# EasyEDA Pro project ProPrj_GoWinSDR_SMT_2025-10-27.epro, schematic Schematic1_1, sheets 1 to 4 of 8

## Sheets
1 CoreConnect: Board Name: Board1; Create Date: 2025-10-20; Page Name: CoreConnect; Project Name: GoWinSDR_SMT; Schematic Name: Schematic1; Update Date: 2025-10-20; Drawed: ConstString; Page Size: A4; Version: V1.0
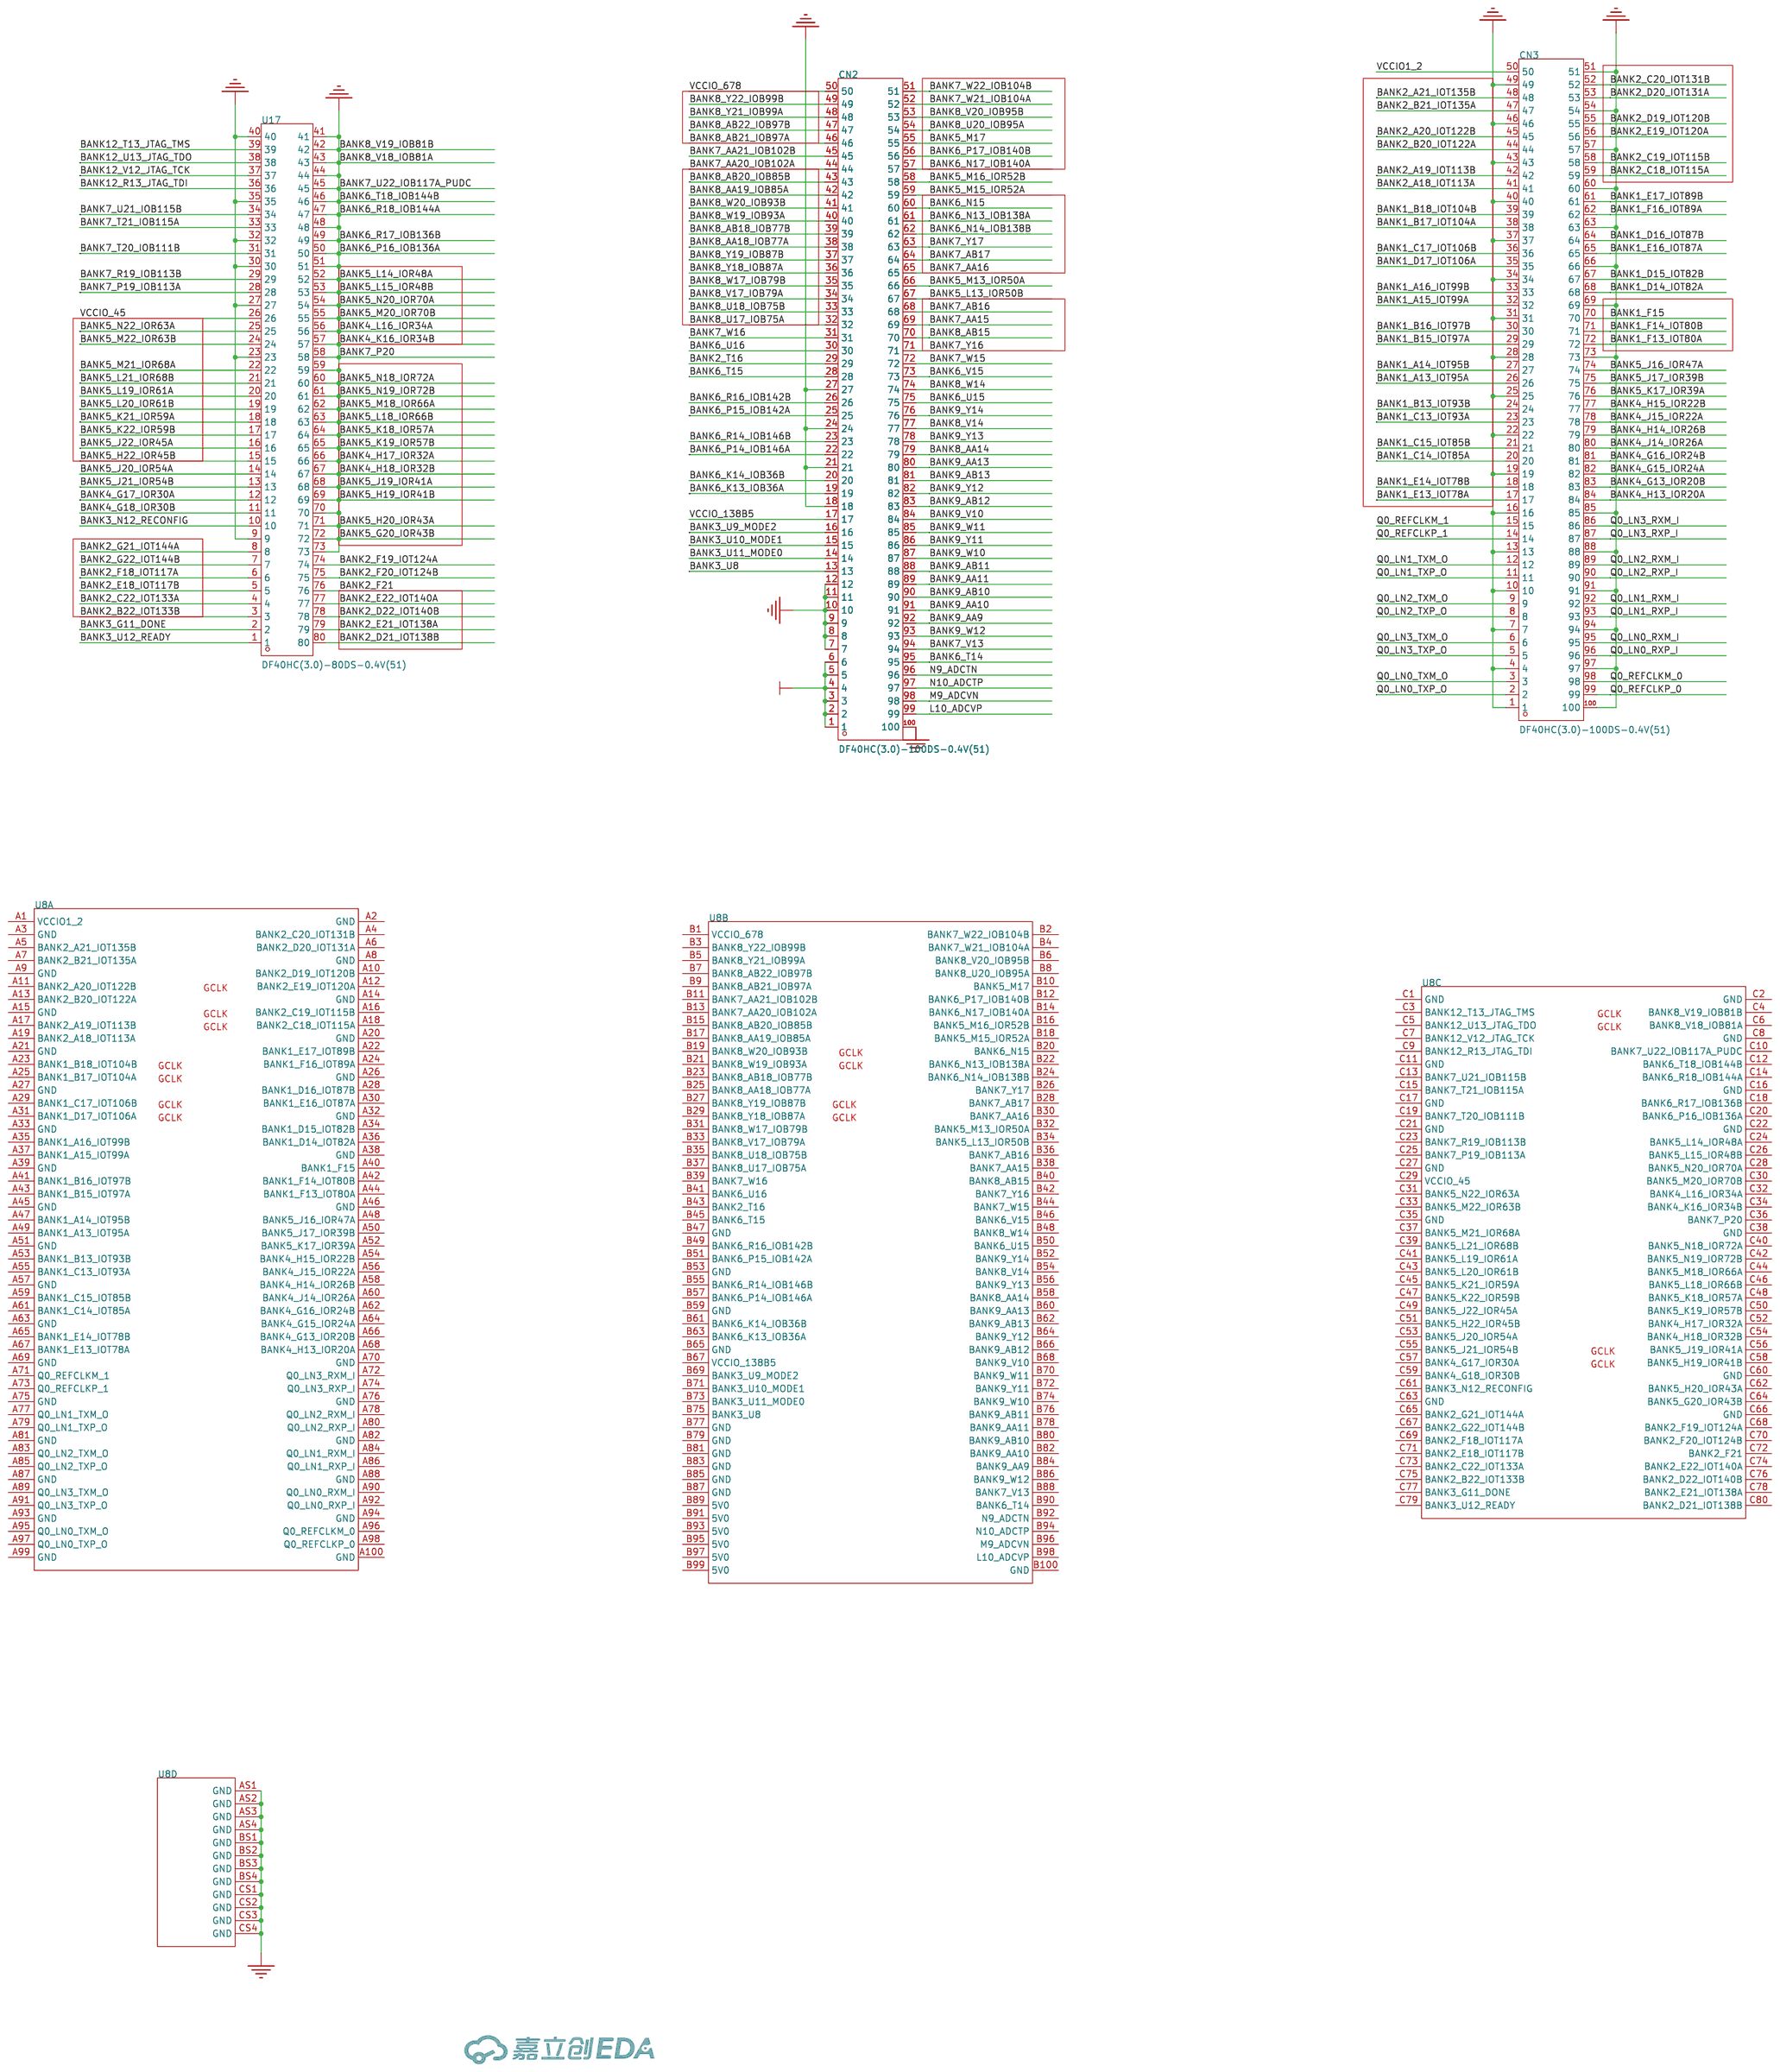
[diagram p0: CoreConnect]
2 AD9363: Create Date: 2025-09-04; Page Name: AD9363; Project Name: GoWinSDR; Update Date: 2025-09-28; Company: 嘉立创EDA
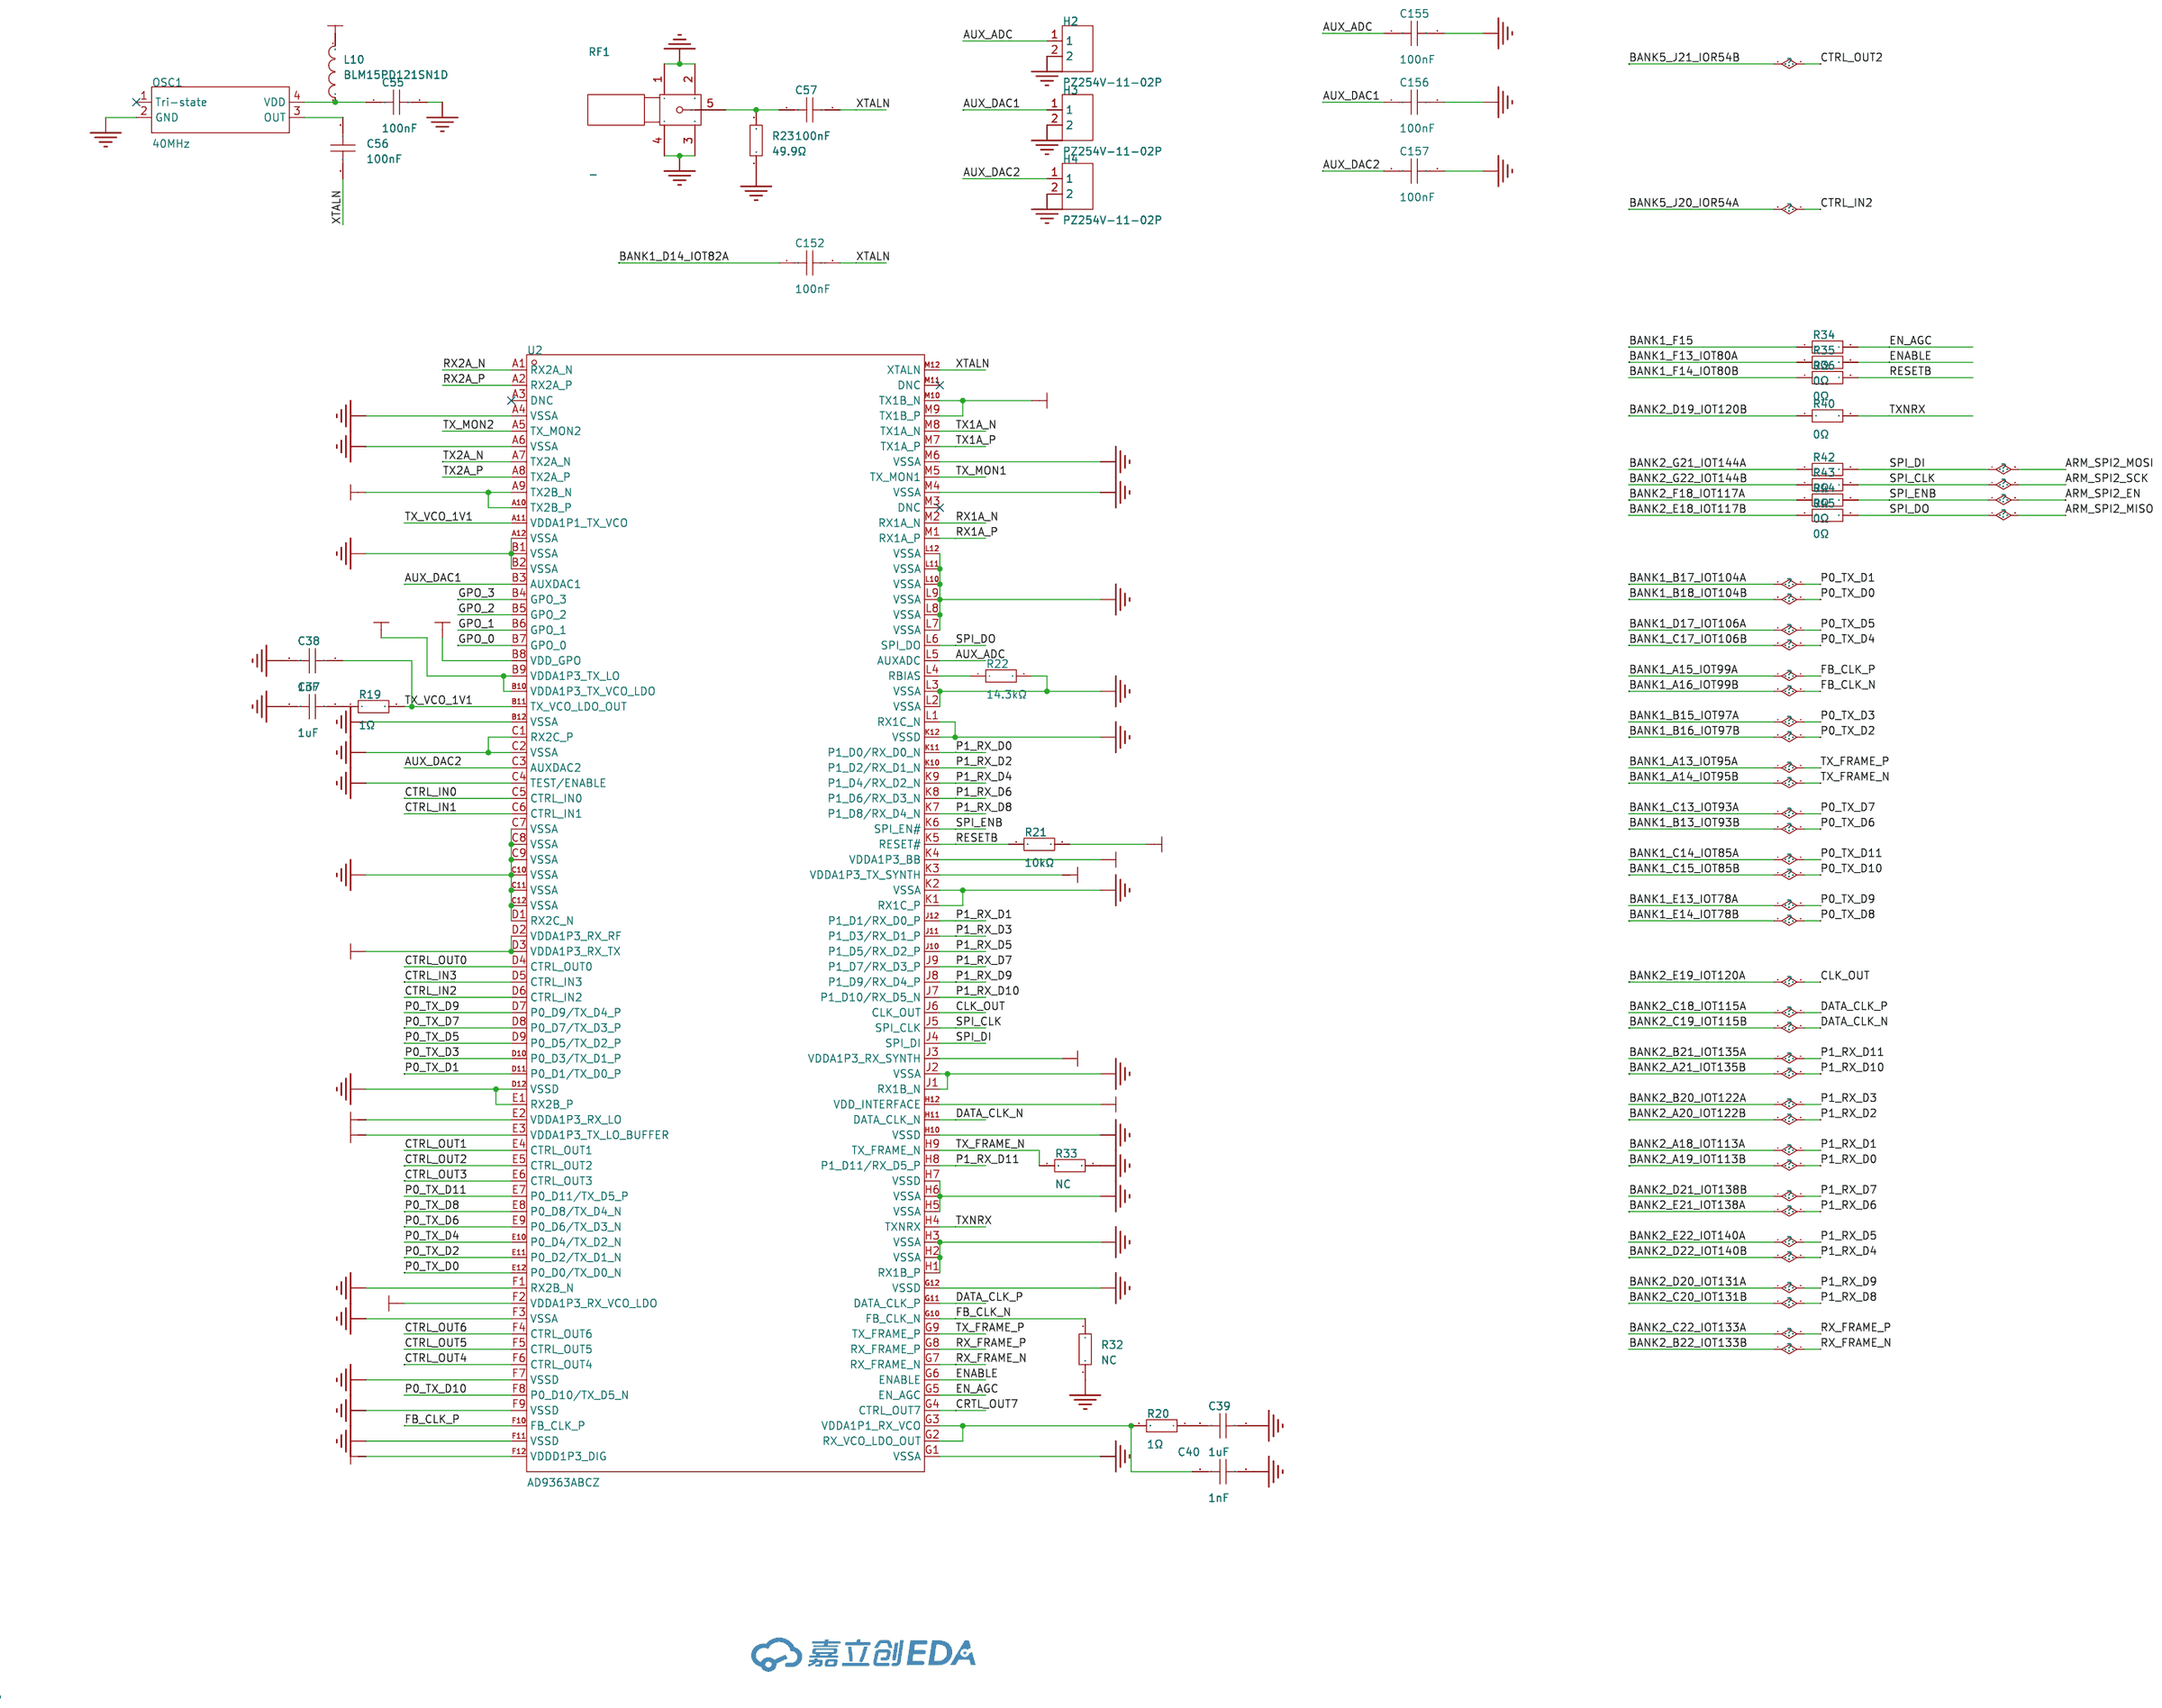
[diagram p1: AD9363]
3 Power: Create Date: 2025-09-04; Page Name: Power; Project Name: GoWinSDR; Update Date: 2025-09-11; Company: 嘉立创EDA
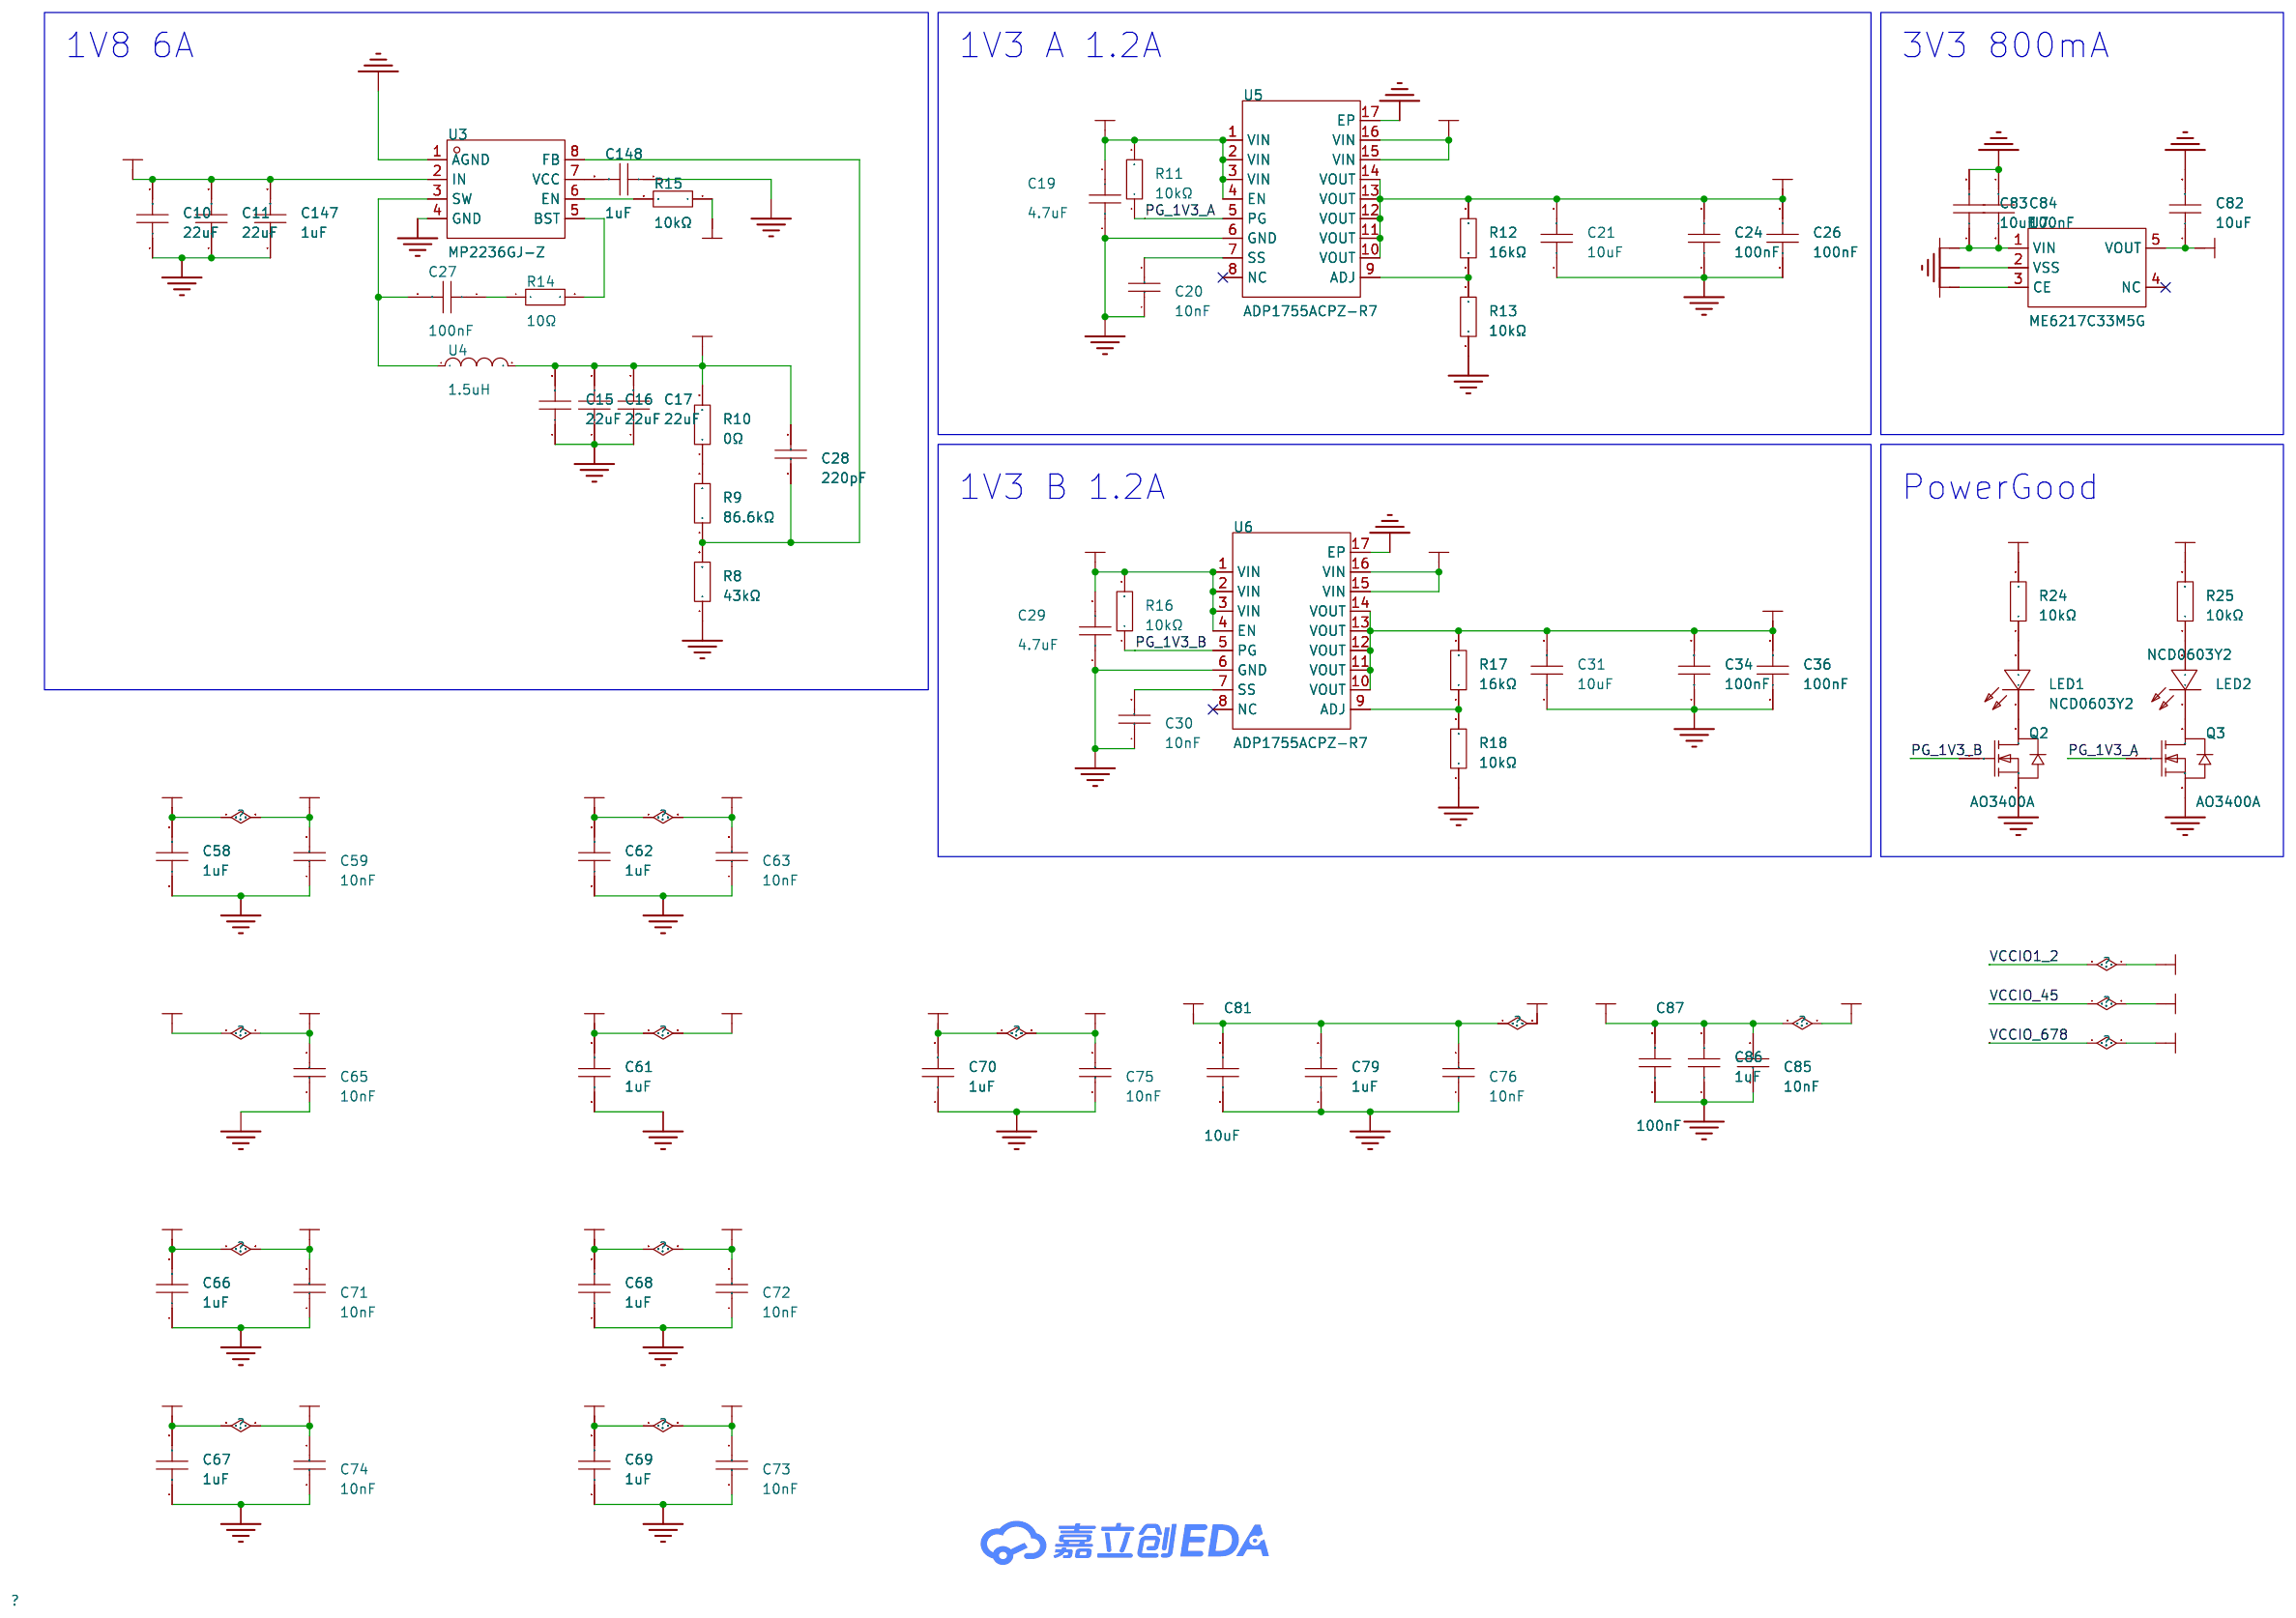
[diagram p2: Power]
4 MCU: Create Date: 2025-09-04; Page Name: MCU; Project Name: GoWinSDR; Update Date: 2025-09-26; Company: 嘉立创EDA
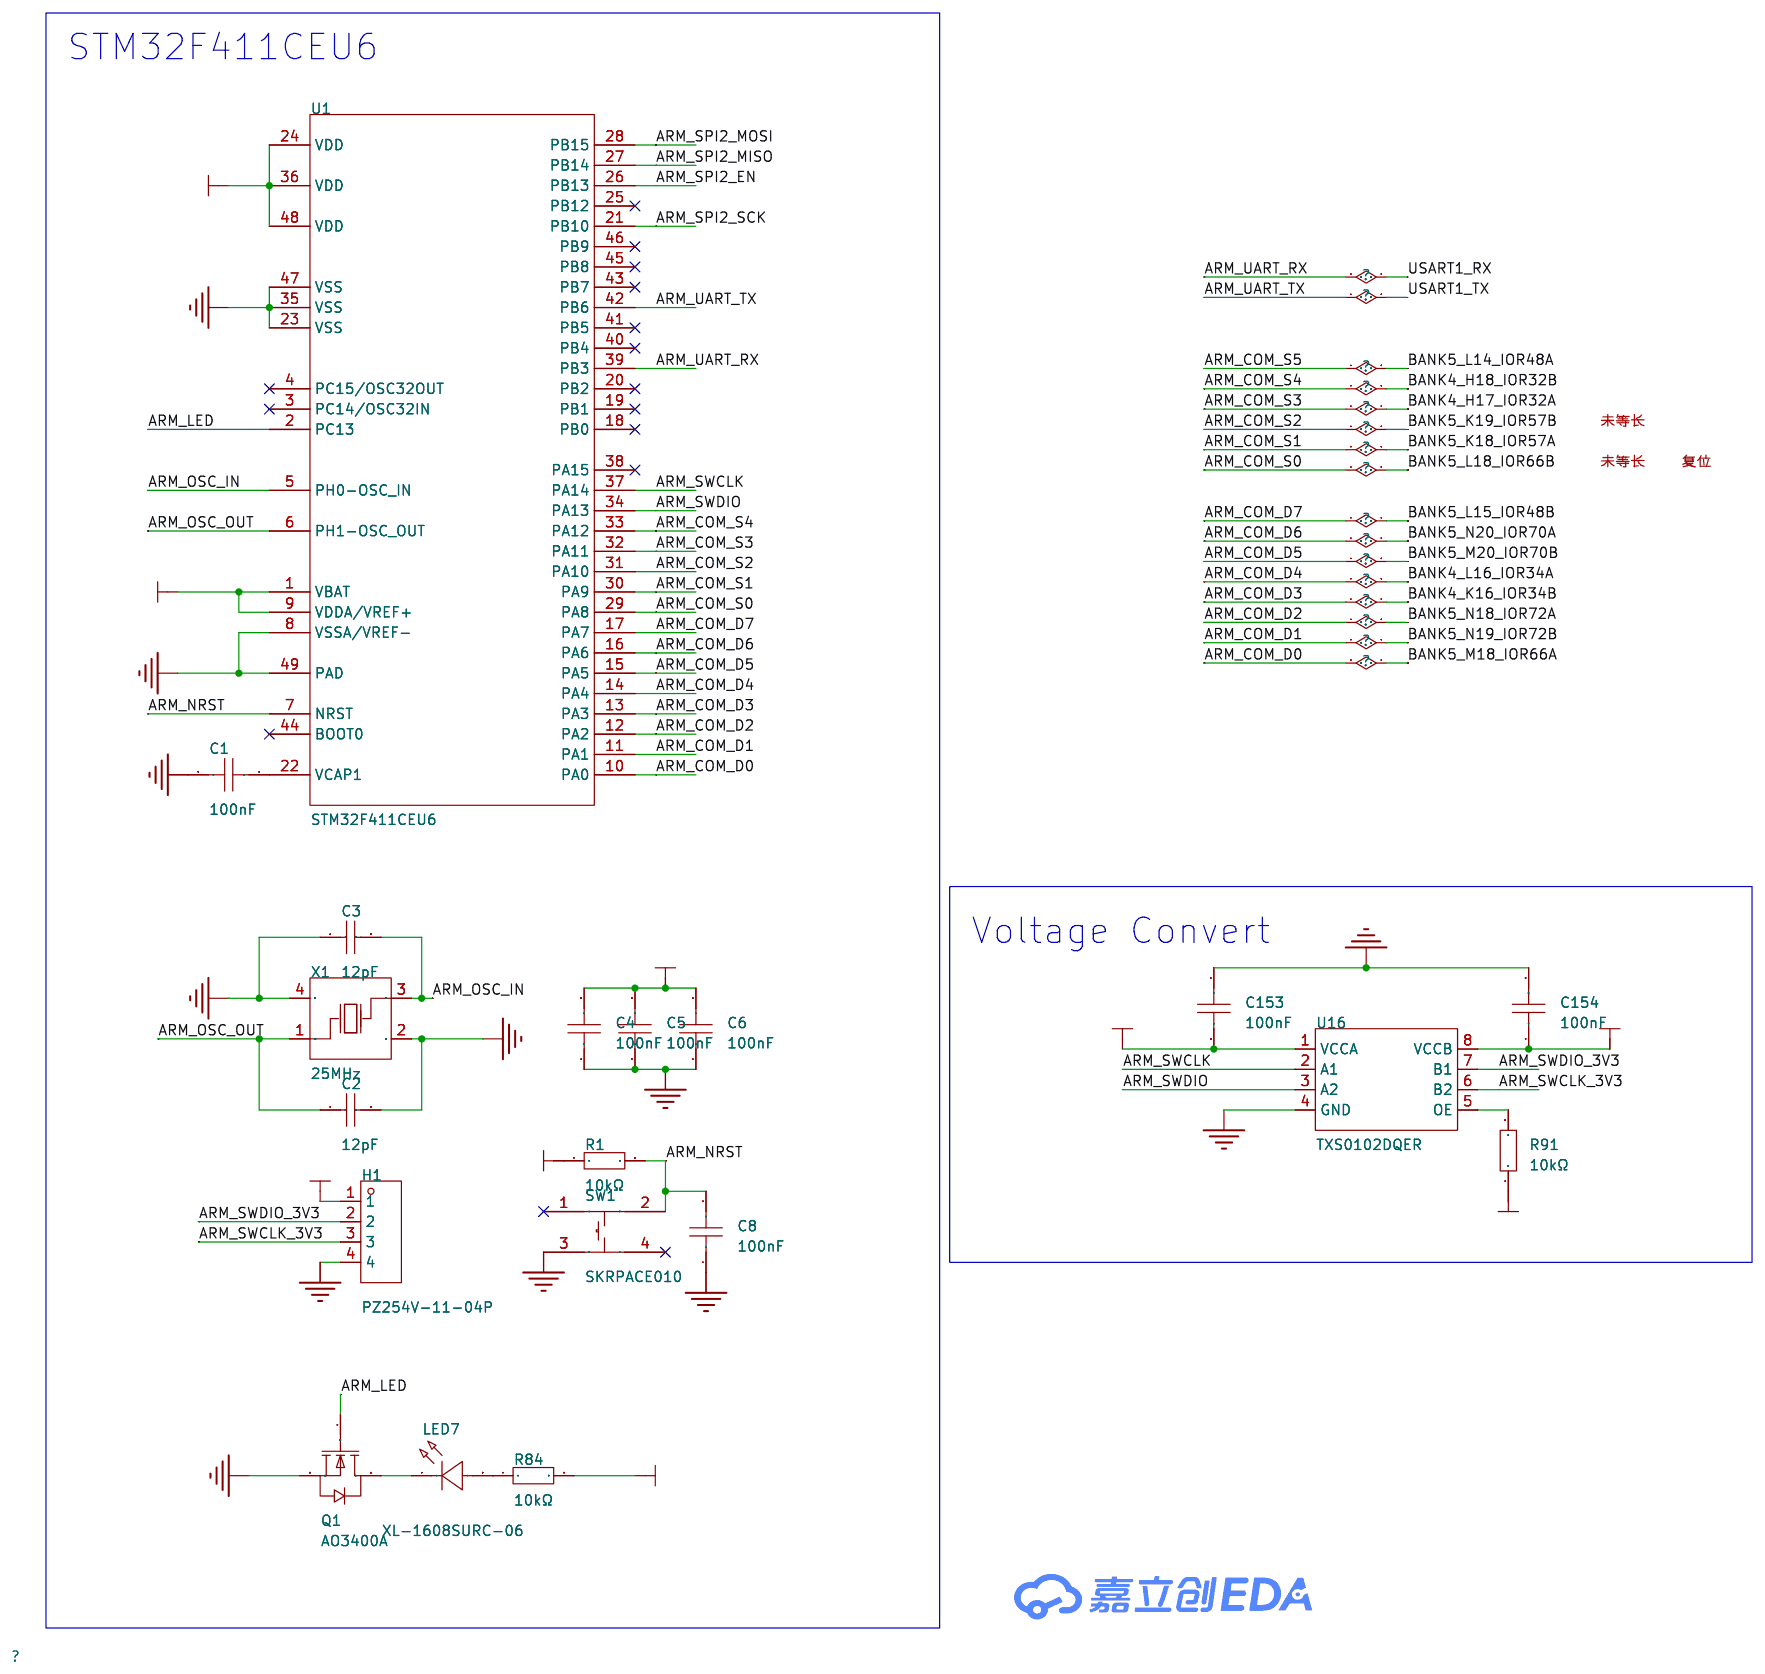
[diagram p3: MCU]

## Parts
sheet AD9363
C37  1uF  [C0402]
C38  1nF  [C0402]
C39  1uF  [C0402]
C40  1nF  [C0402]
C55  100nF  [C0402]
C56  100nF  [C0402]
C57  100nF  [C0402]
C152  100nF  [C0402]
C155  100nF  [C0402]
C156  100nF  [C0402]
C157  100nF  [C0402]
H2  PZ254V-11-02P  [HDR-TH_2P-P2.54-V-M]
H3  PZ254V-11-02P  [HDR-TH_2P-P2.54-V-M]
H4  PZ254V-11-02P  [HDR-TH_2P-P2.54-V-M]
L10  BLM15PD121SN1D  [L0402]
OSC1  40MHz  [OSC-SMD_4P-L3.2-W2.5-BL]
R19  1Ω  [R0402]
R20  1Ω  [R0402]
R21  10kΩ  [R0402]
R22  14.3kΩ  [R0402]
R23  49.9Ω  [R0402]
R32  NC  [R0402]
R33  NC  [R0402]
R34  0Ω  [R0402]
R35  0Ω  [R0402]
R36  0Ω  [R0402]
R40  0Ω  [R0402]
R42  0Ω  [R0402]
R43  0Ω  [R0402]
R44  0Ω  [R0402]
R45  0Ω  [R0402]
RF1  -  [SMA-TH_BWSMA-KE-Z001]
U2  AD9363ABCZ  [CSPBGA-144_L10.0-W10.0-R12-C12-P0.80-TL]
sheet CoreConnect
CN2  DF40HC(3.0)-100DS-0.4V(51)  [CONN-SMD_DF40HC-3.0-100DS-0.4V-51]
CN3  DF40HC(3.0)-100DS-0.4V(51)  [CONN-SMD_DF40HC-3.0-100DS-0.4V-51]
U8  -  [Tang Mega 60K]  (sections 1,2,3,4)
U17  DF40HC(3.0)-80DS-0.4V(51)  [CONN-SMD_DF40HC-3.0-80DS-0.4V-51]
sheet MCU
C1  100nF  [C0402]
C2  12pF  [C0402]
C3  12pF  [C0402]
C4  100nF  [C0402]
C5  100nF  [C0402]
C6  100nF  [C0402]
C8  100nF  [C0402]
C153  100nF  [C0402]
C154  100nF  [C0402]
H1  PZ254V-11-04P  [HDR-TH_4P-P2.54-V-M]
LED7  XL-1608SURC-06  [LED0603-RD_RED]
Q1  AO3400A  [SOT-23-3_L2.9-W1.3-P1.90-LS2.4-BR]
R1  10kΩ  [R0402]
R84  10kΩ  [R0402]
R91  10kΩ  [R0402]
SW1  SKRPACE010  [KEY-SMD_4P-L4.2-W3.2-P2.20-LS4.6]
U1  STM32F411CEU6  [UFQFPN-48_L7.0-W7.0-P0.50-BL-EP]
U16  TXS0102DQER  [X2SON-8_L1.4-W1.0-P0.35-BL]
X1  25MHz  [CRYSTAL-SMD_4P-L3.2-W2.5-BL]
sheet Power
C10  22uF  [C0805]
C11  22uF  [C0805]
C15  22uF  [C0805]
C16  22uF  [C0805]
C17  22uF  [C0805]
C19  4.7uF  [C0603]
C20  10nF  [C0402]
C21  10uF  [C0603]
C24  100nF  [C0402]
C26  100nF  [C0402]
C27  100nF  [C0402]
C28  220pF  [C0402]
C29  4.7uF  [C0603]
C30  10nF  [C0402]
C31  10uF  [C0603]
C34  100nF  [C0402]
C36  100nF  [C0402]
C58  1uF  [C0402]
C59  10nF  [C0402]
C61  1uF  [C0402]
C62  1uF  [C0402]
C63  10nF  [C0402]
C65  10nF  [C0402]
C66  1uF  [C0402]
C67  1uF  [C0402]
C68  1uF  [C0402]
C69  1uF  [C0402]
C70  1uF  [C0402]
C71  10nF  [C0402]
C72  10nF  [C0402]
C73  10nF  [C0402]
C74  10nF  [C0402]
C75  10nF  [C0402]
C76  10nF  [C0402]
C79  1uF  [C0402]
C81  10uF  [C0603]
C82  10uF  [C0603]
C83  10uF  [C0603]
C84  100nF  [C0603]
C85  10nF  [C0402]
C86  1uF  [C0402]
C87  100nF  [C0402]
C147  1uF  [C0402]
C148  1uF  [C0402]
LED1  NCD0603Y2  [LED0603-RD]
LED2  NCD0603Y2  [LED0603-RD]
Q2  AO3400A  [SOT-23-3_L2.9-W1.3-P1.90-LS2.4-BR]
Q3  AO3400A  [SOT-23-3_L2.9-W1.3-P1.90-LS2.4-BR]
R8  43kΩ  [R0402]
R9  86.6kΩ  [R0402]
R10  0Ω  [R0402]
R11  10kΩ  [R0402]
R12  16kΩ  [R0402]
R13  10kΩ  [R0402]
R14  10Ω  [R0402]
R15  10kΩ  [R0402]
R16  10kΩ  [R0402]
R17  16kΩ  [R0402]
R18  10kΩ  [R0402]
R24  10kΩ  [R0402]
R25  10kΩ  [R0402]
U3  MP2236GJ-Z  [SOT-23-8_L2.9-W1.6-P0.65-LS2.8-BR]
U4  1.5uH  [IND-SMD_L2.5-W2.0_MEKK2520TR47M]
U5  ADP1755ACPZ-R7  [LFCSP-16_L4.0-W4.0-P0.65-BL-EP2.2]
U6  ADP1755ACPZ-R7  [LFCSP-16_L4.0-W4.0-P0.65-BL-EP2.2]
U7  ME6217C33M5G  [SOT-23-5_L3.0-W1.7-P0.95-LS2.8-BR]

## Library data of the parts
C37 C39 C58 C61 C62 C66-C70 C79 C86 C147 C148 = CL05A105KA5NQNC: 容值:1uF;精度:±10%;额定电压:25V;温度系数:X5R;; LCSC Part Name: 1uF ±10% 25V; Supplier Part: C52923; Manufacturer: SAMSUNG(三星); Supplier Footprint: 0402; JLCPCB Part Class: 基础库; Datasheet: https://item.szlcsc.com/datasheet/CL05A105KA5NQNC/53938.html; Supplier: LCSC; Tolerance: ±10%; Voltage Rating: 25V; Temperature Coefficient: X5R
C38 C40 = GRM1555C1H102JA01D: 容值:1nF;精度:±5%;额定电压:50V;温度系数:C0G;; LCSC Part Name: 1nF ±5% 50V; Supplier Part: C76947; Manufacturer: muRata(村田); Supplier Footprint: 0402; JLCPCB Part Class: 扩展库; Datasheet: https://item.szlcsc.com/datasheet/GRM1555C1H102JA01D/78074.html; Supplier: LCSC; Tolerance: ±5%; Voltage Rating: 50V; Temperature Coefficient: C0G
C1 C4-C6 C8 C24 C26 C27 C34 C36 C55 C57 C87 C152-C157 = CL05B104KB54PNC: 容值:100nF;精度:±10%;额定电压:50V;温度系数:X7R;; LCSC Part Name: 100nF ±10% 50V; Supplier Part: C307331; Manufacturer: SAMSUNG(三星); Supplier Footprint: 0402; JLCPCB Part Class: 基础库; Datasheet: https://item.szlcsc.com/datasheet/CL05B104KB54PNC/291005.html; Supplier: LCSC; Tolerance: ±10%; Voltage Rating: 50V; Temperature Coefficient: X7R
C56 = CL05B104KO5NNNC: 容值:100nF;精度:±10%;额定电压:16V;材质(温度系数):X7R;; LCSC Part Name: 100nF ±10% 16V; Supplier Part: C1525; Manufacturer: SAMSUNG(三星); Supplier Footprint: 0402; JLCPCB Part Class: 基础库; Datasheet: https://atta.szlcsc.com/upload/public/pdf/source/20160218/1457707763339.pdf; Supplier: LCSC; Tolerance: ±10%; Voltage Rated: 16V; Temperature Coefficient: X7R
H2-H4 = PZ254V-11-02P: 插针结构:1x2P;间距:2.54mm;行距:-;圆针/方针:方针;安装方式:直插;排数:单排;总PIN位数:2P;额定电流:-;额定电压:-;配合针长度:6mm;塑高:2.5mm;端接针长度:3mm;触头材质:黄铜;触头镀层:-;工作温度:-40℃~+105℃;颜色:黑色;; LCSC Part Name: 1x2P 间距:2.54mm 方针 直插; Supplier Part: C492401; Manufacturer: XFCN(兴飞); Supplier Footprint: 插件,P=2.54mm; JLCPCB Part Class: 扩展库; Datasheet: https://item.szlcsc.com/datasheet/PZ254V-11-02P/502957.html; Supplier: LCSC; Pin Structure: 1x2P; Pitch: 2.54mm; Circluar Pins/Square Pins: 方针; Mounting Type: 直插; Number of Rows: 单排; Number of Pins: 2P; Length of Mating Pin: 6mm; Insulation Height: 2.5mm; Length of End Connection Pin: 3mm; Contact Material: 黄铜; Operating Temperature: -40℃~+105℃; Color: 黑色
L10 = BLM15PD121SN1D: 阻抗@频率:120Ω@100MHz;误差:±25%;直流电阻(DCR):90mΩ;; LCSC Part Name: 单路 0402磁珠 阻抗120Ω@100MHz; Supplier Part: C76891; Manufacturer: muRata(村田); Supplier Footprint: 0402; JLCPCB Part Class: 扩展库; Datasheet: https://item.szlcsc.com/datasheet/BLM15PD121SN1D/78018.html; Supplier: LCSC; Impedance @ Frequency: 120Ω@100MHz; Tolerance: ±25%; DC Resistance(DCR): 90mΩ; Current Rating: 1.3A; Number of Circuits: 1; Operating Temperature: -55℃~+125℃
OSC1 = OT2EL4C4JI-111OLP-40M: 频率:40MHz;常温频差:±10ppm;输出模式:CMOS;工作电压:1.8V~3.3V;频率稳定度:±20ppm;; LCSC Part Name: YSO110TR 40MHZ 4P 3225 1.8V-3.3V ±10PPM -40~85℃ (±20PPM) CMOS; Supplier Part: C5203551; Manufacturer: YXC(扬兴晶振); Supplier Footprint: SMD3225-4P; JLCPCB Part Class: 扩展库; Datasheet: https://item.szlcsc.com/datasheet/OT2EL4C4JI-111OLP-40M/5892913.html; Supplier: LCSC; Normal temperature Frequency Tolerance: ±10ppm; Output Type: CMOS; Voltage - Supply: 1.8V~3.3V; Frequency Stability: ±20ppm; Operating Temperature: -40℃~+85℃
R19 R20 R32 R33 = 0402WGF100KTCE: 电阻类型:厚膜电阻;阻值:1Ω;精度:±1%;功率:62.5mW;工作电压:50V;温度系数:±200ppm/℃;; LCSC Part Name: 1Ω ±1% 62.5mW 厚膜电阻; Supplier Part: C25086; Manufacturer: UNI-ROYAL(厚声); Supplier Footprint: 0402; JLCPCB Part Class: 扩展库; Datasheet: https://item.szlcsc.com/datasheet/0402WGF100KTCE/25829.html; Supplier: LCSC; Type: 厚膜电阻; Tolerance: ±1%; Power(Watts): 62.5mW; Voltage-Supply(Max): 50V; Temperature Coefficient: ±200ppm/℃; Operating Temperature: -55℃~+155℃
R1 R11 R13 R15 R16 R18 R21 R84 R91 = 0402WGF1002TCE: 电阻类型:厚膜电阻;阻值:10kΩ;精度:±1%;功率:62.5mW;工作电压:50V;温度系数:±100ppm/℃;; LCSC Part Name: 10kΩ ±1% 62.5mW 厚膜电阻; Supplier Part: C25744; Manufacturer: UNI-ROYAL(厚声); Supplier Footprint: 0402; JLCPCB Part Class: Basic Part; Datasheet: https://item.szlcsc.com/datasheet/0402WGF1002TCE/26487.html; Supplier: LCSC; Type: 厚膜电阻; Tolerance: ±1%; Power(Watts): 62.5mW; Voltage-Supply(Max): 50V; Temperature Coefficient: ±100ppm/℃; Operating Temperature: -55℃~+155℃
R22 = 0402WGF1432TCE: 电阻类型:厚膜电阻;阻值:14.3kΩ;精度:±1%;功率:62.5mW;工作电压:50V;温度系数:±100ppm/℃;; LCSC Part Name: 14.3kΩ ±1% 62.5mW 厚膜电阻; Supplier Part: C25855; Manufacturer: UNI-ROYAL(厚声); Supplier Footprint: 0402; JLCPCB Part Class: 扩展库; Datasheet: https://item.szlcsc.com/datasheet/0402WGF1432TCE/26598.html; Supplier: LCSC; Type: 厚膜电阻; Tolerance: ±1%; Power(Watts): 62.5mW; Voltage-Supply(Max): 50V; Temperature Coefficient: ±100ppm/℃; Operating Temperature: -55℃~+155℃
R23 = 0402WGF499JTCE: 电阻类型:厚膜电阻;阻值:49.9Ω;精度:±1%;功率:62.5mW;工作电压:50V;温度系数:±100ppm/℃;; LCSC Part Name: 49.9Ω ±1% 62.5mW 厚膜电阻; Supplier Part: C25120; Manufacturer: UNI-ROYAL(厚声); Supplier Footprint: 0402; JLCPCB Part Class: 基础库; Datasheet: https://item.szlcsc.com/datasheet/0402WGF499JTCE/25863.html; Supplier: LCSC; Type: 厚膜电阻; Tolerance: ±1%; Power(Watts): 62.5mW; Voltage-Supply(Max): 50V; Temperature Coefficient: ±100ppm/℃; Operating Temperature: -55℃~+155℃
R34-R36 R40 R42-R45 = 0402WGF0000TCE: 电阻类型:厚膜电阻;阻值:0Ω;精度:±1%;功率:62.5mW;工作电压:50V;温度系数:±800ppm/℃;; LCSC Part Name: 0Ω ±1% 62.5mW 厚膜电阻; Supplier Part: C17168; Manufacturer: UNI-ROYAL(厚声); Supplier Footprint: 0402; JLCPCB Part Class: 基础库; Datasheet: https://item.szlcsc.com/datasheet/0402WGF0000TCE/17853.html; Supplier: LCSC; Type: 厚膜电阻; Tolerance: ±1%; Power(Watts): 62.5mW; Voltage-Supply(Max): 50V; Temperature Coefficient: ±800ppm/℃; Operating Temperature: -55℃~+155℃
RF1 = BWSMA-KE-Z001_C496549: 连接器类型:板端;接口类型:内孔;端口数量:1;接口直径:-;接口长度/高度:-;频率:-;射频系列:SMA;阻抗:50Ω;样式:正脚;工作温度:-65℃~+165℃;; LCSC Part Name: 内孔 SMA 正脚; Supplier Part: C496549; Manufacturer: BAT WIRELESS(蝙蝠无线); Manufacturer Part: BWSMA-KE-Z001; Supplier Footprint: 插件; JLCPCB Part Class: 扩展库; Datasheet: https://item.szlcsc.com/datasheet/BWSMA-KE-Z001/508498.html; Supplier: LCSC; Connector Type: 板端; Interface: 内孔; Number of Ports: 1; RF Series: SMA; Impedance: 50Ω; Style: 正脚; Operating Temperature Range: -65℃~+165℃
U2 = AD9363ABCZ: 频率范围:325MHz~3.8GHz;接口类型:SPI;数据速率:61.44Mbps;灵敏度:-;; LCSC Part Name: RF捷变收发器; Supplier Part: C653459; Manufacturer: ADI(亚德诺); Supplier Footprint: BGA-144; JLCPCB Part Class: 扩展库; Datasheet: https://atta.szlcsc.com/upload/public/pdf/source/20220412/30BFD9AEBDDCA38EF2B895CFB1D3E141.pdf; Supplier: LCSC; Frequency Range: 325MHz~3.8GHz; Interface: SPI; Voltage - Supply: 1.3V; Output Power: 8dBm; Data Rate: 61.44Mbps; Current Of Transmitting: 660mA; Receive Current: 660mA; Operating Temperature: -40℃~+85℃
CN2 CN3 = DF40HC(3.0)-100DS-0.4V(51): PIN总数:-;间距:0.4mm;公母:母;安装方式:立贴;行数:2;额定电流:300mA;工作温度范围:-35℃~+85℃;; LCSC Part Name: 间距:0.4mm 母 立贴; Supplier Part: C424649; Manufacturer: HRS(广濑); Supplier Footprint: SMD,P=0.4mm; JLCPCB Part Class: 扩展库; Datasheet: https://atta.szlcsc.com/upload/public/pdf/source/20190903/C424648_4BEB475664B3701E3114D0DD20EED667.pdf; Supplier: LCSC; Pitch: 0.4mm; Gender: 母; Mounting Style: 立贴; Number of Rows: 2; Current Rating (Max): 300mA; Contact Plating: 金; Operating Temperature Range: -35℃~+85℃
U8 = Tang Mega 60K SOM
U17 = DF40HC(3.0)-80DS-0.4V(51): Supplier Part: C2858577; Manufacturer: HRS(广濑); Supplier Footprint: SMD-80P; JLCPCB Part Class: 扩展库; Datasheet: https://atta.szlcsc.com/upload/public/pdf/source/20230606/0B5E5A86E73E3C10B9AA04C1C9019B32.pdf; Supplier: LCSC
C2 C3 = 0402CG120J500NT: 容值:12pF;精度:±5%;额定电压:50V;温度系数:C0G;; LCSC Part Name: 12pF ±5% 50V; Supplier Part: C1547; Manufacturer: FH(风华); Supplier Footprint: 0402; JLCPCB Part Class: 基础库; Datasheet: https://item.szlcsc.com/datasheet/0402CG120J500NT/1899.html; Supplier: LCSC; Tolerance: ±5%; Voltage Rating: 50V; Temperature Coefficient: C0G
H1 = PZ254V-11-04P: 插针结构:1x4P;间距:2.54mm;行距:-;圆针/方针:方针;安装方式:直插;排数:单排;总PIN位数:4P;额定电流:3A;额定电压:250V;配合针长度:6mm;塑高:2.5mm;端接针长度:3mm;触头材质:-;工作温度:-40℃~+105℃;颜色:黑色;; LCSC Part Name: 1x4P 间距:2.54mm 方针 直插; Supplier Part: C2691448; Manufacturer: XFCN(兴飞); Supplier Footprint: 插件,P=2.54mm; JLCPCB Part Class: 扩展库; Datasheet: https://item.szlcsc.com/datasheet/PZ254V-11-04P/2801085.html; Supplier: LCSC; Pin Structure: 1x4P; Pitch: 2.54mm; Circluar Pins/Square Pins: 方针; Mounting Type: 直插; Number of Rows: 单排; Number of Pins: 4P; Current Rating: 3A; Voltage Rating (Max): 250V; Length of Mating Pin: 6mm; Insulation Height: 2.5mm; Length of End Connection Pin: 3mm; Operating Temperature: -40℃~+105℃; Color: 黑色
LED7 = XL-1608SURC-06: 灯头类型:-;发光颜色:红色;正向压降(Vf):2.3V;功率:50mW;正向电流:20mA;波长:620nm~630nm;二极管配置:-;透镜颜色:无色透明透镜;色温:-;发光强度:225mcd;发光角度:120°;载带方式:正贴;工作温度:-20℃~+85℃;; Supplier Part: C965799; Manufacturer: XINGLIGHT(成兴光); Supplier Footprint: 0603; JLCPCB Part Class: 扩展库; Datasheet: https://atta.szlcsc.com/upload/public/pdf/source/20250213/F9766CE804AF391355DCDD48DB3E0DAB.pdf; Supplier: LCSC; Illumination Color: 红色; Voltage - Forward(Vf): 2.3V; Power(Watts): 50mW; Forward Current: 20mA; Wavelength - Dominant: 620nm~630nm; Peak Wavelength: 625nm; Lens Color: 无色透明透镜; Luminous Intensity: 225mcd; Viewing Angle: 120°; Mounting Sytle: 正贴; Operating Temperature: -20℃~+85℃
Q1-Q3 = AO3400A_C20917: 数量:-;漏源电压(Vdss):30V;连续漏极电流(Id):-;导通电阻(RDS(on)):48mΩ@2.5V;耗散功率(Pd):-;阈值电压(Vgs(th)):1.45V@250uA;; LCSC Part Name: 1个N沟道 耐压:30V 电流:5.7A; Supplier Part: C20917; Manufacturer: AOS; Supplier Footprint: SOT-23-3L; JLCPCB Part Class: 基础库; Datasheet: https://item.szlcsc.com/datasheet/AO3400A/21629.html; Supplier: LCSC; Drain to Source Voltage: 30V; RDS(on): 48mΩ@2.5V; Gate Threshold Voltage (Vgs(th)): 1.45V@250uA; Gate Charge(Qg): 7nC@10V; Input Capacitance(Ciss): 630pF@15V; Operating Temperature: -55℃~+150℃@(Tj); Type: N沟道
SW1 = SKRPACE010: 电路结构:单刀单掷;按钮形状:椭圆形按钮;安装方式:立贴;开关长度:4.2mm;开关宽度:3.2mm;开关高度:2.5mm;触点电流:50mA;额定电压(DC):16V;带灯:-;机械寿命:-;; LCSC Part Name: 4.2*3.2*2.5mm 立贴 轻触开关; Supplier Part: C139797; Manufacturer: ALPSALPINE(阿尔卑斯阿尔派); Supplier Footprint: SMD; JLCPCB Part Class: 扩展库; Datasheet: https://atta.szlcsc.com/upload/public/pdf/source/20171113/C139797_15105612676371115729.pdf; Supplier: LCSC; Circuit: 单刀单掷; Actuator Style: 椭圆形按钮; Mounting Style: 立贴; Switch Length: 4.2mm; Switch Width: 3.2mm; Switch Height: 2.5mm; Contact Current: 50mA; Voltage Rating (DC): 16V
U1 = STM32F411CEU6: CPU内核:ARM-M4;CPU最大主频:100MHz;应用领域:-;; LCSC Part Name: 带DSP和FPU的高性能基本型系列ARM Cortex-M4 MCU，具有512 KB Flash、100 MHz CPU和ART加速器; Supplier Part: C60420; Manufacturer: ST(意法半导体); Supplier Footprint: UFQFPN-48(7x7); JLCPCB Part Class: 扩展库; Datasheet: https://item.szlcsc.com/datasheet/STM32F411CEU6/61472.html; Supplier: LCSC; CPU Core: ARM-M4; CPU Maximum Speed: 100MHz; Program Storage Size: 512KB; Program Memory Type: FLASH; Number of I/O: 36; ADC (Bit): 12bit; Voltage - Supply: 1.7V~3.6V
U16 = TXS0102DQER: 数据速率:24Mbps;工作电压(VCCA):1.65V~3.6V;工作电压(VCCB):2.3V~5.5V;通道数:1;每个电路通道数:2;; LCSC Part Name: 24Mbps 2位双向电平转换器; Supplier Part: C2652935; Manufacturer: TI(德州仪器); Supplier Footprint: X2-SON-8(1x1.4); JLCPCB Part Class: 扩展库; Datasheet: https://www.ti.com/cn/lit/gpn/txs0102; Supplier: LCSC; Channel Type: 双向; Data Rate: 24Mbps; Voltage - Supply(VCCA): 1.65V~3.6V; Voltage - Supply(VCCB): 2.3V~5.5V; Number of Circuits: 2; Output Type: 开漏；推挽式; Operating Temperature: -40℃~+85℃; Features: 自动方向检测
X1 = X322525MOB4SI: 晶振类型:贴片晶振;频率:25MHz;常温频差:±10ppm;负载电容:12pF;频率稳定度:±20ppm;; LCSC Part Name: YSX321SL 25MHZ 4P 3225 12PF ±10PPM -40~85℃ (±20PPM); Supplier Part: C9006; Manufacturer: YXC(扬兴晶振); Supplier Footprint: SMD3225-4P; JLCPCB Part Class: 基础库; Datasheet: https://item.szlcsc.com/datasheet/X322525MOB4SI/9526.html; Supplier: LCSC; Type: 贴片晶振; Normal temperature Frequency Tolerance: ±10ppm; Load Capacitance: 12pF; Frequency Stability: ±20ppm; Operating Temperature: -40℃~+85℃
C10 C11 C15-C17 = CGA0805X5R226M350MT: 容值:22uF;精度:±20%;额定电压:35V;材质(温度系数):X5R;; LCSC Part Name: 22uF ±20% 35V; Supplier Part: C6119901; Manufacturer: HRE(芯声); Supplier Footprint: 0805; JLCPCB Part Class: 扩展库; Datasheet: https://atta.szlcsc.com/upload/public/pdf/source/20231129/D589D0CC4D260F7AC3A77E53B455CCB3.pdf; Supplier: LCSC; Tolerance: ±20%; Voltage Rated: 35V; Temperature Coefficient: X5R
C19 C29 = CL10A475KO8NNNC: 容值:4.7uF;精度:±10%;额定电压:16V;温度系数:X5R;; LCSC Part Name: 4.7uF ±10% 16V; Supplier Part: C19666; Manufacturer: SAMSUNG(三星); Supplier Footprint: 0603; JLCPCB Part Class: 基础库; Datasheet: https://item.szlcsc.com/datasheet/CL10A475KO8NNNC/20375.html; Supplier: LCSC; Tolerance: ±10%; Voltage Rating: 16V; Temperature Coefficient: X5R
C20 C30 = CL05B103KB5NNNC: 容值:10nF;精度:±10%;额定电压:50V;温度系数:X7R;; LCSC Part Name: 10nF ±10% 50V; Supplier Part: C15195; Manufacturer: SAMSUNG(三星); Supplier Footprint: 0402; JLCPCB Part Class: 基础库; Datasheet: https://item.szlcsc.com/datasheet/CL05B103KB5NNNC/15869.html; Supplier: LCSC; Tolerance: ±10%; Voltage Rating: 50V; Temperature Coefficient: X7R
C21 C31 C81-C83 = CGA0603X5R106K100JT: 容值:10uF;精度:±10%;额定电压:10V;温度系数:X5R;; LCSC Part Name: 10uF ±10% 10V; Supplier Part: C6119842; Manufacturer: HRE(芯声); Supplier Footprint: 0603; JLCPCB Part Class: 扩展库; Supplier: LCSC; Tolerance: ±10%; Voltage Rating: 10V; Temperature Coefficient: X5R
C28 = 0402B221K500NT: 容值:220pF;精度:±10%;额定电压:50V;温度系数:X7R;; LCSC Part Name: 220pF ±10% 50V; Supplier Part: C1530; Manufacturer: FH(风华); Supplier Footprint: 0402; JLCPCB Part Class: 基础库; Datasheet: https://atta.szlcsc.com/upload/public/pdf/source/20200305/C486355_26A10D38EF8C2A5C37091D0039909270.pdf; Supplier: LCSC; Tolerance: ±10%; Voltage Rating: 50V; Temperature Coefficient: X7R
C59 C63 C65 C71-C76 C85 = CC0402KRX7R9BB103: 容值:10nF;精度:±10%;额定电压:50V;温度系数:X7R;; LCSC Part Name: 10nF ±10% 50V; Supplier Part: C60133; Manufacturer: YAGEO(国巨); Supplier Footprint: 0402; JLCPCB Part Class: 扩展库; Datasheet: https://item.szlcsc.com/datasheet/CC0402KRX7R9BB103/61185.html; Supplier: LCSC; Tolerance: ±10%; Voltage Rating: 50V; Temperature Coefficient: X7R
C84 = CGA0603X7R104K500JT: 容值:100nF;精度:±10%;额定电压:50V;温度系数:X7R;; LCSC Part Name: 100nF ±10% 50V; Supplier Part: C6119867; Manufacturer: HRE(芯声); Supplier Footprint: 0603; JLCPCB Part Class: 扩展库; Datasheet: https://atta.szlcsc.com/upload/public/pdf/source/20250103/C44077DA9E7B3EFAE02F22B6D3D1CBC9.pdf; Supplier: LCSC; Tolerance: ±10%; Voltage Rating: 50V; Temperature Coefficient: X7R
LED1 LED2 = NCD0603Y2: 发光颜色:黄色;正向电压(VF):1.6V~2.6V;功率:65mW;正向电流:20mA;主波长:586nm~595nm;透镜颜色:无色透明透镜;发光强度:100mcd~220mcd;发光角度:130°;工作温度:-30℃~+85℃;; Supplier Part: C89811; Manufacturer: 国星光电; Supplier Footprint: 0603; JLCPCB Part Class: 扩展库; Datasheet: https://atta.szlcsc.com/upload/public/pdf/source/20200820/C89811_7FE84B429B6BCA3E113B125EE1452576.pdf; Supplier: LCSC; Emitted Color: 黄色; Forward Voltage (VF): 1.6V~2.6V; Power Dissipation: 65mW; Forward Current: 20mA; Dominant Wavelength: 586nm~595nm; Lens Color: 无色透明透镜; Luminous Intensity: 100mcd~220mcd; Viewing Angle: 130°; Operating Temperature: -30℃~+85℃
R8 = 0402WGF4302TCE: 电阻类型:厚膜电阻;阻值:43kΩ;精度:±1%;功率:62.5mW;最大工作电压:50V;温度系数:±100ppm/℃;; LCSC Part Name: 43kΩ ±1% 62.5mW 厚膜电阻; Supplier Part: C8329; Manufacturer: UNI-ROYAL(厚声); Supplier Footprint: 0402; JLCPCB Part Class: 扩展库; Datasheet: https://atta.szlcsc.com/upload/public/pdf/source/20200306/C422600_1E6D84923E4A46A82E41ADD87F860B5C.pdf; Supplier: LCSC; Type: 厚膜电阻; Tolerance: ±1%; Power(Watts): 62.5mW; Overload Voltage (Max): 50V; Temperature Coefficient: ±100ppm/℃; Operating Temperature Range: -55℃~+155℃
R9 = 0402WGF8662TCE: 电阻类型:厚膜电阻;阻值:86.6kΩ;精度:±1%;功率:62.5mW;工作电压:50V;温度系数:±100ppm/℃;; LCSC Part Name: 86.6kΩ ±1% 62.5mW 厚膜电阻; Supplier Part: C19709; Manufacturer: UNI-ROYAL(厚声); Supplier Footprint: 0402; JLCPCB Part Class: 扩展库; Datasheet: https://item.szlcsc.com/datasheet/0402WGF8662TCE/20418.html; Supplier: LCSC; Type: 厚膜电阻; Tolerance: ±1%; Power(Watts): 62.5mW; Voltage-Supply(Max): 50V; Temperature Coefficient: ±100ppm/℃; Operating Temperature: -55℃~+155℃
R10 = RC0402FR-070RL: 电阻类型:厚膜电阻;阻值:0Ω;精度:±1%;功率:62.5mW;工作电压:50V;温度系数:-;; LCSC Part Name: 厚膜电阻 0Ω ±1% 62.5mW; Supplier Part: C106231; Manufacturer: YAGEO(国巨); Supplier Footprint: 0402; JLCPCB Part Class: 扩展库; Datasheet: https://item.szlcsc.com/datasheet/RC0402FR-070RL/107446.html; Supplier: LCSC; Type: 厚膜电阻; Tolerance: ±1%; Power(Watts): 62.5mW; Voltage-Supply(Max): 50V; Operating Temperature: -55℃~+155℃
R12 R17 = 0402WGF1602TCE: 电阻类型:厚膜电阻;阻值:16kΩ;精度:±1%;功率:62.5mW;工作电压:50V;温度系数:±100ppm/℃;; LCSC Part Name: 16kΩ ±1% 62.5mW 厚膜电阻; Supplier Part: C25759; Manufacturer: UNI-ROYAL(厚声); Supplier Footprint: 0402; JLCPCB Part Class: 扩展库; Datasheet: https://item.szlcsc.com/datasheet/0402WGF1602TCE/26502.html; Supplier: LCSC; Type: 厚膜电阻; Tolerance: ±1%; Power(Watts): 62.5mW; Voltage-Supply(Max): 50V; Temperature Coefficient: ±100ppm/℃; Operating Temperature: -55℃~+155℃
R14 = 0402WGF100JTCE: 电阻类型:厚膜电阻;阻值:10Ω;精度:±1%;功率:62.5mW;最大工作电压:50V;温度系数:±200ppm/℃;; LCSC Part Name: 10Ω ±1% 62.5mW 厚膜电阻; Supplier Part: C25077; Manufacturer: UNI-ROYAL(厚声); Supplier Footprint: 0402; JLCPCB Part Class: 基础库; Datasheet: https://atta.szlcsc.com/upload/public/pdf/source/20200306/C422600_1E6D84923E4A46A82E41ADD87F860B5C.pdf; Supplier: LCSC; Type: 厚膜电阻; Tolerance: ±1%; Power(Watts): 62.5mW; Overload Voltage (Max): 50V; Temperature Coefficient: ±200ppm/℃; Operating Temperature Range: -55℃~+155℃
R24 R25 = 0402WGF4701TCE: 电阻类型:厚膜电阻;阻值:4.7kΩ;精度:±1%;功率:62.5mW;工作电压:50V;温度系数:±100ppm/℃;; LCSC Part Name: 4.7kΩ ±1% 62.5mW 厚膜电阻; Supplier Part: C25900; Manufacturer: UNI-ROYAL(厚声); Supplier Footprint: 0402; JLCPCB Part Class: 基础库; Datasheet: https://item.szlcsc.com/datasheet/0402WGF4701TCE/26643.html; Supplier: LCSC; Type: 厚膜电阻; Tolerance: ±1%; Power(Watts): 62.5mW; Voltage-Supply(Max): 50V; Temperature Coefficient: ±100ppm/℃; Operating Temperature: -55℃~+155℃
U3 = MP2236GJ-Z_C6910059: 功能类型:降压型;输出类型:可调;工作电压:3V~18V;输出电压:600mV~8V;输出电流:6A;; Supplier Part: C6910059; Manufacturer: MPS(芯源); Supplier Footprint: TSOT-23-8; JLCPCB Part Class: 扩展库; Datasheet: https://atta.szlcsc.com/upload/public/pdf/source/20240130/7276A2FA400B12E2129A1551DAE110FA.pdf; Supplier: LCSC; Function: 降压型; Output Type: 可调; Input Voltage: 3V~18V; Output Voltage: 600mV~8V; Output Current: 6A; Switching Frequency: 600kHz; Operating Temperature: -40℃~+125℃@(TJ); Synchronous Rectification: 是; Number of Outputs: 1; Topology: 降压式; Switch tube (built-in/external): 内置
U4 = FTC252012S1R5MBCA: 电感值:1.5uH;精度:±20%;额定电流:3.7A;饱和电流(Isat):4.5A;类型:-;; LCSC Part Name: 1.5uH ±20% 4.5A; Supplier Part: C5832371; Manufacturer: cjiang(长江微电); Supplier Footprint: SMD,2x2.5mm; JLCPCB Part Class: 扩展库; Datasheet: https://atta.szlcsc.com/upload/public/pdf/source/20240918/5AD8A1A0D9C2859F32750FF2CC514AFA.pdf; Supplier: LCSC; Tolerance: ±20%; Current Rating: 3.7A; Current - Saturation(Isat): 4.5A; DC Resistance(DCR): 44mΩ
U5 U6 = ADP1755ACPZ-R7: 输出类型:可调;最大输入电压:3.6V;输出电压:750mV~3.3V;输出电流:1.2A;输出极性:正极;; LCSC Part Name: 1.2 A、低VIN、低压差线性稳压器; Supplier Part: C403695; Manufacturer: ADI(亚德诺); Supplier Footprint: LFCSP-16(4x4); JLCPCB Part Class: 扩展库; Datasheet: https://atta.szlcsc.com/upload/public/pdf/source/20190709/C403695_79C722DB4A97FB0A65992417FDA600B4.pdf; Supplier: LCSC; Output Type: 可调; Maximum Input Voltage: 3.6V; Output Voltage: 750mV~3.3V; Output Current: 1.2A; Dropout Voltage: 200mV@(1.2A); standby current: 800uA; Operating Temperature: -40℃~+125℃; Output Polarity: 正极; Number of Outputs: 1
U7 = ME6217C33M5G: 输出类型:固定;工作电压:6.5V;输出电压:3.3V;输出电流:800mA;电源纹波抑制比(PSRR):65dB@(1kHz);输出极性:正极;; LCSC Part Name: 输入7V 输出3.3V 800mA; Supplier Part: C427602; Manufacturer: MICRONE(南京微盟); Supplier Footprint: SOT-23-5; JLCPCB Part Class: 扩展库; Datasheet: https://item.szlcsc.com/datasheet/ME6217C33M5G/421842.html; Supplier: LCSC; Output Type: 固定; Voltage - Supply: 6.5V; Output Voltage: 3.3V; Output Current: 800mA; Power Supply Rejection Ratio (PSRR): 65dB@(1kHz); Voltage Dropout: 180mV@(300mA); standby current: 100uA; Features: 过热保护；带使能; Operating Temperature: -40℃~+85℃; Output Configuration: 正极; Number of Outputs: 1

## Nets
1V3_A: C21.2 C24.2 C26.2 C58.2 C59.2 C61.2 C62.2 C63.2 C65.2 R12.2 U2.B9(VDDA1P3_TX_LO) U2.B10(VDDA1P3_TX_VCO_LDO) U2.E2(VDDA1P3_RX_LO) U2.F2(VDDA1P3_RX_VCO_LDO) U2.J3(VDDA1P3_RX_SYNTH) U2.K3(VDDA1P3_TX_SYNTH) U5.10(VOUT) U5.11(VOUT) U5.12(VOUT) U5.13(VOUT) U5.14(VOUT)
1V3_B: C31.2 C34.2 C36.2 C66.2 C67.2 C68.2 C69.2 C70.2 C71.2 C72.2 C73.2 C74.2 C75.2 R17.2 U2.A9(TX2B_N) U2.A10(TX2B_P) U2.D2(VDDA1P3_RX_RF) U2.D3(VDDA1P3_RX_TX) U2.E3(VDDA1P3_TX_LO_BUFFER) U2.F12(VDDD1P3_DIG) U2.K4(VDDA1P3_BB) U2.M9(TX1B_P) U2.M10(TX1B_N) U6.10(VOUT) U6.11(VOUT) U6.12(VOUT) U6.13(VOUT) U6.14(VOUT) ; also on sheet 6
1V8: C4.2 C5.2 C6.2 C15.2 C16.2 C17.2 C19.2 C28.2 C29.2 C76.2 C79.2 C81.2 C153.2 CN2.50 CN3.50 L10.2 R1.1 R10.2 R11.2 R16.2 R21.2 R91.1 U1.1(VBAT) U1.9(VDDA/VREF+) U1.24(VDD) U1.36(VDD) U1.48(VDD) U2.H12(VDD_INTERFACE) U4.2 U5.1(VIN) U5.2(VIN) U5.3(VIN) U5.4(EN) U5.15(VIN) U5.16(VIN) U6.1(VIN) U6.2(VIN) U6.3(VIN) U6.4(EN) U6.15(VIN) U6.16(VIN) U16.1(VCCA) U17.26
3V3: C82.1 C85.2 C86.2 C87.2 C154.1 U2.B8(VDD_GPO) U7.5(VOUT) U16.8(VCCB) ; also on sheet 5
5V: C10.2 C11.2 C83.1 C84.2 C147.2 CN2.1 CN2.2 CN2.3 CN2.4 CN2.5 CN2.6 H1.1 R15.1 R24.2 R25.2 R84.2 U3.2(IN) U7.1(VIN) U7.3(CE) ; also on sheet 5 7 8
GND: C1.1 C2.2 C3.1 C4.1 C5.1 C6.1 C8.1 C10.1 C11.1 C15.1 C16.1 C17.1 C19.1 C20.1 C21.1 C24.1 C26.1 C29.1 C30.1 C31.1 C34.1 C36.1 C37.1 C38.2 C39.1 C40.2 C55.2 C58.1 C59.1 C61.1 C62.1 C63.1 C65.1 C66.1 C67.1 C68.1 C69.1 C70.1 C71.1 C72.1 C73.1 C74.1 C75.1 C76.1 C79.1 C81.1 C82.2 C83.2 C84.1 C85.1 C86.1 C87.1 C147.1 C148.1 C153.1 C154.2 C155.2 C156.2 C157.2 CN2.7 CN2.8 CN2.9 CN2.10 CN2.11 CN2.12 CN2.18 CN2.21 CN2.24 CN2.27 CN2.100 CN3.1 CN3.4 CN3.7 CN3.10 CN3.13 CN3.16 CN3.19 CN3.22 CN3.25 CN3.28 CN3.31 CN3.34 CN3.37 CN3.40 CN3.43 CN3.46 CN3.49 CN3.51 CN3.54 CN3.57 CN3.60 CN3.63 CN3.66 CN3.69 CN3.73 CN3.85 CN3.88 CN3.91 CN3.94 CN3.97 CN3.100 H1.4 H2.2 H3.2 H4.2 OSC1.2(GND) Q1.2(S) Q2.2(S) Q3.2(S) R8.1 R13.1 R18.1 R22.2 R23.1 R32.2 R33.2 RF1.1 RF1.2 RF1.3 RF1.4 SW1.3 U1.8(VSSA/VREF-) U1.23(VSS) U1.35(VSS) U1.47(VSS) U1.49(PAD) U2.A4(VSSA) U2.A6(VSSA) U2.A12(VSSA) U2.B1(VSSA) U2.B2(VSSA) U2.B12(VSSA) U2.C1(RX2C_P) U2.C2(VSSA) U2.C4(TEST/ENABLE) U2.C7(VSSA) U2.C8(VSSA) U2.C9(VSSA) U2.C10(VSSA) U2.C11(VSSA) U2.C12(VSSA) U2.D1(RX2C_N) U2.D12(VSSD) U2.E1(RX2B_P) U2.F1(RX2B_N) U2.F3(VSSA) U2.F7(VSSD) U2.F9(VSSD) U2.F11(VSSD) U2.G1(VSSA) U2.G12(VSSD) U2.H1(RX1B_P) U2.H2(VSSA) U2.H3(VSSA) U2.H5(VSSA) U2.H6(VSSA) U2.H7(VSSD) U2.H10(VSSD) U2.J1(RX1B_N) U2.J2(VSSA) U2.K1(RX1C_P) U2.K2(VSSA) U2.K12(VSSD) U2.L1(RX1C_N) U2.L2(VSSA) U2.L3(VSSA) U2.L7(VSSA) U2.L8(VSSA) U2.L9(VSSA) U2.L10(VSSA) U2.L11(VSSA) U2.L12(VSSA) U2.M4(VSSA) U2.M6(VSSA) U3.1(AGND) U3.4(GND) U5.6(GND) U5.17(EP) U6.6(GND) U6.17(EP) U7.2(VSS) U8.AS1(GND) U8.AS2(GND) U8.AS3(GND) U8.AS4(GND) U8.BS1(GND) U8.BS2(GND) U8.BS3(GND) U8.BS4(GND) U8.CS1(GND) U8.CS2(GND) U8.CS3(GND) U8.CS4(GND) U16.4(GND) U17.9 U17.23 U17.27 U17.30 U17.32 U17.35 U17.40 U17.41 U17.44 U17.48 U17.51 U17.59 U17.70 U17.73 X1.2(GND) X1.4(GND) ; also on sheet 5 6 7 8
VCCIO_138B5: CN2.17
ARM_COM_D0: U1.10(PA0) U17.62
ARM_COM_D1: U1.11(PA1) U17.61
ARM_COM_D2: U1.12(PA2) U17.60
ARM_COM_D3: U1.13(PA3) U17.57
ARM_COM_D4: U1.14(PA4) U17.56
ARM_COM_D5: U1.15(PA5) U17.55
ARM_COM_D6: U1.16(PA6) U17.54
ARM_COM_D7: U1.17(PA7) U17.53
ARM_COM_S0: U1.29(PA8) U17.63
ARM_COM_S1: U1.30(PA9) U17.64
ARM_COM_S2: U1.31(PA10) U17.65
ARM_COM_S3: U1.32(PA11) U17.66
ARM_COM_S4: U1.33(PA12) U17.67
ARM_COM_S5: U17.52
ARM_LED: Q1.1(G) U1.2(PC13)
ARM_NRST: C8.2 R1.2 SW1.2 U1.7(NRST)
ARM_OSC_IN: C3.2 U1.5(PH0-OSC_IN) X1.3(OSC2)
ARM_OSC_OUT: C2.1 U1.6(PH1-OSC_OUT) X1.1(OSC1)
ARM_SPI2_EN: R44.2 U1.26(PB13) U2.K6(SPI_EN#)
ARM_SPI2_MISO: R45.2 U1.27(PB14) U2.L6(SPI_DO)
ARM_SPI2_MOSI: R42.2 U1.28(PB15) U2.J4(SPI_DI)
ARM_SPI2_SCK: R43.2 U1.21(PB10) U2.J5(SPI_CLK)
ARM_SWCLK: U1.37(PA14) U16.2(A1)
ARM_SWCLK_3V3: H1.3 U16.6(B2)
ARM_SWDIO: U1.34(PA13) U16.3(A2)
ARM_SWDIO_3V3: H1.2 U16.7(B1)
ARM_UART_RX: U1.39(PB3) ; also on sheet 5
ARM_UART_TX: U1.42(PB6) ; also on sheet 5
AUX_ADC: C155.1 H2.1 U2.L5(AUXADC)
AUX_DAC1: C156.1 H3.1 U2.B3(AUXDAC1)
AUX_DAC2: C157.1 H4.1 U2.C3(AUXDAC2)
BANK1_A13_IOT95A: CN3.26 U2.G9(TX_FRAME_P)
BANK1_A14_IOT95B: CN3.27 R33.1 U2.H9(TX_FRAME_N)
BANK1_A15_IOT99A: CN3.32 U2.F10(FB_CLK_P)
BANK1_A16_IOT99B: CN3.33 R32.1 U2.G10(FB_CLK_N)
BANK1_B13_IOT93B: CN3.24 U2.E9(P0_D6/TX_D3_N)
BANK1_B15_IOT97A: CN3.29 U2.D10(P0_D3/TX_D1_P)
BANK1_B16_IOT97B: CN3.30 U2.E11(P0_D2/TX_D1_N)
BANK1_B17_IOT104A: CN3.38 U2.D11(P0_D1/TX_D0_P)
BANK1_B18_IOT104B: CN3.39 U2.E12(P0_D0/TX_D0_N)
BANK1_C13_IOT93A: CN3.23 U2.D8(P0_D7/TX_D3_P)
BANK1_C14_IOT85A: CN3.20 U2.E7(P0_D11/TX_D5_P)
BANK1_C15_IOT85B: CN3.21 U2.F8(P0_D10/TX_D5_N)
BANK1_C17_IOT106B: CN3.36 U2.E10(P0_D4/TX_D2_N)
BANK1_D14_IOT82A: C152.1 CN3.68
BANK1_D15_IOT82B: CN3.67
BANK1_D16_IOT87B: CN3.64
BANK1_D17_IOT106A: CN3.35 U2.D9(P0_D5/TX_D2_P)
BANK1_E13_IOT78A: CN3.17 U2.D7(P0_D9/TX_D4_P)
BANK1_E14_IOT78B: CN3.18 U2.E8(P0_D8/TX_D4_N)
BANK1_E16_IOT87A: CN3.65
BANK1_E17_IOT89B: CN3.61
BANK1_F13_IOT80A: CN3.72 R35.1
BANK1_F14_IOT80B: CN3.71 R36.1
BANK1_F15: CN3.70 R34.1
BANK1_F16_IOT89A: CN3.62
BANK2_A18_IOT113A: CN3.41 U2.J12(P1_D1/RX_D0_P)
BANK2_A19_IOT113B: CN3.42 U2.K11(P1_D0/RX_D0_N)
BANK2_A20_IOT122B: CN3.45 U2.K10(P1_D2/RX_D1_N)
BANK2_A21_IOT135B: CN3.48 U2.J7(P1_D10/RX_D5_N)
BANK2_B20_IOT122A: CN3.44 U2.J11(P1_D3/RX_D1_P)
BANK2_B21_IOT135A: CN3.47 U2.H8(P1_D11/RX_D5_P)
BANK2_B22_IOT133B: U2.G7(RX_FRAME_N) U17.3
BANK2_C18_IOT115A: CN3.59 U2.G11(DATA_CLK_P)
BANK2_C19_IOT115B: CN3.58 U2.H11(DATA_CLK_N)
BANK2_C20_IOT131B: CN3.52 U2.K7(P1_D8/RX_D4_N)
BANK2_C22_IOT133A: U2.G8(RX_FRAME_P) U17.4
BANK2_D19_IOT120B: CN3.55 R40.1
BANK2_D20_IOT131A: CN3.53 U2.J8(P1_D9/RX_D4_P)
BANK2_D21_IOT138B: U2.J9(P1_D7/RX_D3_P) U17.80
BANK2_D22_IOT140B: U2.K9(P1_D4/RX_D2_N) U17.78
BANK2_E18_IOT117B: R45.1 U17.5
BANK2_E19_IOT120A: CN3.56 U2.J6(CLK_OUT)
BANK2_E21_IOT138A: U2.K8(P1_D6/RX_D3_N) U17.79
BANK2_E22_IOT140A: U2.J10(P1_D5/RX_D2_P) U17.77
BANK2_F18_IOT117A: R44.1 U17.6
BANK2_F19_IOT124A: U17.74
BANK2_F20_IOT124B: U17.75
BANK2_F21: U17.76
BANK2_G21_IOT144A: R42.1 U17.8
BANK2_G22_IOT144B: R43.1 U17.7
BANK2_T16: CN2.29
BANK3_G11_DONE: U17.2
BANK3_N12_RECONFIG: U17.10
BANK3_U8: CN2.13
BANK3_U9_MODE2: CN2.16
BANK3_U10_MODE1: CN2.15
BANK3_U11_MODE0: CN2.14
BANK3_U12_READY: U17.1
BANK4_G13_IOR20B: CN3.83
BANK4_G15_IOR24A: CN3.82
BANK4_G16_IOR24B: CN3.81
BANK4_G17_IOR30A: U17.12
BANK4_G18_IOR30B: U17.11
BANK4_H13_IOR20A: CN3.84
BANK4_H14_IOR26B: CN3.79
BANK4_H15_IOR22B: CN3.77
BANK4_J14_IOR26A: CN3.80
BANK4_J15_IOR22A: CN3.78
BANK5_G20_IOR43B: U17.72
BANK5_H19_IOR41B: U17.69 ; also on sheet 8
BANK5_H20_IOR43A: U17.71 ; also on sheet 8
BANK5_H22_IOR45B: U17.15 ; also on sheet 8
BANK5_J16_IOR47A: CN3.74
BANK5_J17_IOR39B: CN3.75
BANK5_J19_IOR41A: U17.68 ; also on sheet 8
BANK5_J20_IOR54A: U2.D6(CTRL_IN2) U17.14
BANK5_J21_IOR54B: U2.E5(CTRL_OUT2) U17.13
BANK5_J22_IOR45A: U17.16 ; also on sheet 8
BANK5_K17_IOR39A: CN3.76
BANK5_K21_IOR59A: U17.18 ; also on sheet 8
BANK5_K22_IOR59B: U17.17 ; also on sheet 8
BANK5_L13_IOR50B: CN2.67
BANK5_L19_IOR61A: U17.20 ; also on sheet 8
BANK5_L20_IOR61B: U17.19 ; also on sheet 8
BANK5_L21_IOR68B: U17.21 ; also on sheet 8
BANK5_M13_IOR50A: CN2.66
BANK5_M15_IOR52A: CN2.59
BANK5_M16_IOR52B: CN2.58
BANK5_M17: CN2.55
BANK5_M21_IOR68A: U17.22 ; also on sheet 8
BANK5_M22_IOR63B: U17.24 ; also on sheet 8
BANK5_N22_IOR63A: U17.25 ; also on sheet 8
BANK6_K13_IOB36A: CN2.19
BANK6_K14_IOB36B: CN2.20
BANK6_N13_IOB138A: CN2.61
BANK6_N14_IOB138B: CN2.62
BANK6_N15: CN2.60
BANK6_N17_IOB140A: CN2.57
BANK6_P14_IOB146A: CN2.22
BANK6_P15_IOB142A: CN2.25
BANK6_P16_IOB136A: U17.50
BANK6_P17_IOB140B: CN2.56
BANK6_R14_IOB146B: CN2.23
BANK6_R16_IOB142B: CN2.26
BANK6_R17_IOB136B: U17.49
BANK6_R18_IOB144A: U17.47
BANK6_T14: CN2.95
BANK6_T15: CN2.28
BANK6_T18_IOB144B: U17.46
BANK6_U15: CN2.75
BANK6_U16: CN2.30
BANK6_V15: CN2.73
BANK7_AA15: CN2.69
BANK7_AA16: CN2.65
BANK7_AA20_IOB102A: CN2.44
BANK7_AA21_IOB102B: CN2.45
BANK7_AB16: CN2.68
BANK7_AB17: CN2.64
BANK7_P19_IOB113A: U17.28
BANK7_P20: U17.58
BANK7_R19_IOB113B: U17.29
BANK7_T20_IOB111B: U17.31
BANK7_T21_IOB115A: U17.33
BANK7_U21_IOB115B: U17.34
BANK7_U22_IOB117A_PUDC: U17.45
BANK7_V13: CN2.94
BANK7_W15: CN2.72
BANK7_W16: CN2.31
BANK7_W21_IOB104A: CN2.52
BANK7_W22_IOB104B: CN2.51
BANK7_Y16: CN2.71
BANK7_Y17: CN2.63
BANK8_AA14: CN2.79
BANK8_AA18_IOB77A: CN2.38 ; also on sheet 7
BANK8_AA19_IOB85A: CN2.42 ; also on sheet 7
BANK8_AB15: CN2.70
BANK8_AB18_IOB77B: CN2.39 ; also on sheet 7
BANK8_AB20_IOB85B: CN2.43 ; also on sheet 7
BANK8_AB21_IOB97A: CN2.46 ; also on sheet 7
BANK8_AB22_IOB97B: CN2.47 ; also on sheet 7
BANK8_U17_IOB75A: CN2.32 ; also on sheet 7
BANK8_U18_IOB75B: CN2.33 ; also on sheet 7
BANK8_U20_IOB95A: CN2.54
BANK8_V14: CN2.77
BANK8_V17_IOB79A: CN2.34 ; also on sheet 7
BANK8_V18_IOB81A: U17.43
BANK8_V19_IOB81B: U17.42
BANK8_V20_IOB95B: CN2.53
BANK8_W14: CN2.74
BANK8_W17_IOB79B: CN2.35 ; also on sheet 7
BANK8_W19_IOB93A: CN2.40 ; also on sheet 7
BANK8_W20_IOB93B: CN2.41 ; also on sheet 7
BANK8_Y18_IOB87A: CN2.36 ; also on sheet 7
BANK8_Y19_IOB87B: CN2.37 ; also on sheet 7
BANK8_Y21_IOB99A: CN2.48 ; also on sheet 7
BANK8_Y22_IOB99B: CN2.49 ; also on sheet 7
BANK9_AA9: CN2.92
BANK9_AA10: CN2.91
BANK9_AA11: CN2.89
BANK9_AA13: CN2.80
BANK9_AB10: CN2.90
BANK9_AB11: CN2.88
BANK9_AB12: CN2.83
BANK9_AB13: CN2.81
BANK9_V10: CN2.84
BANK9_W10: CN2.87
BANK9_W11: CN2.85
BANK9_W12: CN2.93
BANK9_Y11: CN2.86
BANK9_Y12: CN2.82
BANK9_Y13: CN2.78
BANK9_Y14: CN2.76
BANK12_R13_JTAG_TDI: U17.36 ; also on sheet 5
BANK12_T13_JTAG_TMS: U17.39 ; also on sheet 5
BANK12_U13_JTAG_TDO: U17.38 ; also on sheet 5
BANK12_V12_JTAG_TCK: U17.37 ; also on sheet 5
CRTL_OUT7: U2.G4(CTRL_OUT7)
CTRL_IN0: U2.C5(CTRL_IN0)
CTRL_IN1: U2.C6(CTRL_IN1)
CTRL_IN3: U2.D5(CTRL_IN3)
CTRL_OUT0: U2.D4(CTRL_OUT0)
CTRL_OUT1: U2.E4(CTRL_OUT1)
CTRL_OUT3: U2.E6(CTRL_OUT3)
CTRL_OUT4: U2.F6(CTRL_OUT4)
CTRL_OUT5: U2.F5(CTRL_OUT5)
CTRL_OUT6: U2.F4(CTRL_OUT6)
EN_AGC: R34.2 U2.G5(EN_AGC)
ENABLE: R35.2 U2.G6(ENABLE)
GPO_0: U2.B7(GPO_0)
GPO_1: U2.B6(GPO_1)
GPO_2: U2.B5(GPO_2)
GPO_3: U2.B4(GPO_3)
L10_ADCVP: CN2.99
M9_ADCVN: CN2.98
N9_ADCTN: CN2.96
N10_ADCTP: CN2.97
PG_1V3_A: Q3.1(G) R11.1 U5.5(PG)
PG_1V3_B: Q2.1(G) R16.1 U6.5(PG)
Q0_LN0_RXM_I: CN3.95
Q0_LN0_RXP_I: CN3.96
Q0_LN0_TXM_O: CN3.3
Q0_LN0_TXP_O: CN3.2
Q0_LN1_RXM_I: CN3.92
Q0_LN1_RXP_I: CN3.93
Q0_LN1_TXM_O: CN3.12
Q0_LN1_TXP_O: CN3.11
Q0_LN2_RXM_I: CN3.89
Q0_LN2_RXP_I: CN3.90
Q0_LN2_TXM_O: CN3.9
Q0_LN2_TXP_O: CN3.8
Q0_LN3_RXM_I: CN3.86
Q0_LN3_RXP_I: CN3.87
Q0_LN3_TXM_O: CN3.6
Q0_LN3_TXP_O: CN3.5
Q0_REFCLKM_0: CN3.98
Q0_REFCLKM_1: CN3.15
Q0_REFCLKP_0: CN3.99
Q0_REFCLKP_1: CN3.14
RESETB: R21.1 R36.2 U2.K5(RESET#)
RX1A_N: U2.M2(RX1A_N) ; also on sheet 6
RX1A_P: U2.M1(RX1A_P) ; also on sheet 6
RX2A_N: U2.A1(RX2A_N) ; also on sheet 6
RX2A_P: U2.A2(RX2A_P) ; also on sheet 6
TX1A_N: U2.M8(TX1A_N) ; also on sheet 6
TX1A_P: U2.M7(TX1A_P) ; also on sheet 6
TX2A_N: U2.A7(TX2A_N) ; also on sheet 6
TX2A_P: U2.A8(TX2A_P) ; also on sheet 6
TX_MON1: U2.M5(TX_MON1) ; also on sheet 6
TX_MON2: U2.A5(TX_MON2) ; also on sheet 6
TX_VCO_1V1: C38.1 R19.2 U2.A11(VDDA1P1_TX_VCO) U2.B11(TX_VCO_LDO_OUT)
TXNRX: R40.2 U2.H4(TXNRX)
XTALN: C56.1 C57.2 C152.2 U2.M12(XTALN)
$2N1720: C37.2 R19.1
$2N3444: C39.2 R20.1
$2N3451: C40.1 R20.2 U2.G2(RX_VCO_LDO_OUT) U2.G3(VDDA1P1_RX_VCO)
$2N3895: R22.1 U2.L4(RBIAS)
$2N4930: C55.1 L10.1 OSC1.4(VDD)
$2N4992: C56.2 OSC1.3(OUT)
$2N5256: C57.1 R23.2 RF1.5
$3N848: R15.2 U3.6(EN)
$3N852: C27.2 U3.3(SW) U4.1
$3N853: C27.1 R14.1
$3N854: R14.2 U3.5(BST)
$3N857: C28.1 R8.2 R9.1 U3.8(FB)
$3N1060: R9.2 R10.1
$3N1717: C20.2 U5.7(SS)
$3N1832: R12.1 R13.2 U5.9(ADJ)
$3N3032: C30.2 U6.7(SS)
$3N3034: R17.1 R18.2 U6.9(ADJ)
$3N15876: C148.2 U3.7(VCC)
$4N680: C1.2 U1.22(VCAP1)
$4N6427: R91.2 U16.5(OE)
Net-(LED1-1): LED1.1(K) Q2.3(D)
Net-(LED1-2): LED1.2(A) R24.1
Net-(LED2-1): LED2.1(K) Q3.3(D)
Net-(LED2-2): LED2.2(A) R25.1
Net-(LED7-1): LED7.1(K) Q1.3(D)
Net-(LED7-2): LED7.2(A) R84.1

Not connected (* = marked no-connect by the designer): OSC1 1(Tri-state)*; SW1 1* 4*; U1 3(PC14/OSC32IN)* 4(PC15/OSC32OUT)* 18(PB0)* 19(PB1)* 20(PB2)* 25(PB12)* 38(PA15)* 40(PB4)* 41(PB5)* 43(PB7)* 44(BOOT0)* 45(PB8)* 46(PB9)*; U2 A3(DNC)* M3(DNC)* M11(DNC)*; U5 8(NC)*; U6 8(NC)*; U7 4(NC)*; U8 A1(VCCIO1_2) A2(GND) A3(GND) A4(BANK2_C20_IOT131B) A5(BANK2_A21_IOT135B) A6(BANK2_D20_IOT131A) A7(BANK2_B21_IOT135A) A8(GND) A9(GND) A10(BANK2_D19_IOT120B) A11(BANK2_A20_IOT122B) A12(BANK2_E19_IOT120A) A13(BANK2_B20_IOT122A) A14(GND) A15(GND) A16(BANK2_C19_IOT115B) A17(BANK2_A19_IOT113B) A18(BANK2_C18_IOT115A) A19(BANK2_A18_IOT113A) A20(GND) A21(GND) A22(BANK1_E17_IOT89B) A23(BANK1_B18_IOT104B) A24(BANK1_F16_IOT89A) A25(BANK1_B17_IOT104A) A26(GND) A27(GND) A28(BANK1_D16_IOT87B) A29(BANK1_C17_IOT106B) A30(BANK1_E16_IOT87A) A31(BANK1_D17_IOT106A) A32(GND) A33(GND) A34(BANK1_D15_IOT82B) A35(BANK1_A16_IOT99B) A36(BANK1_D14_IOT82A) A37(BANK1_A15_IOT99A) A38(GND) A39(GND) A40(BANK1_F15) A41(BANK1_B16_IOT97B) A42(BANK1_F14_IOT80B) A43(BANK1_B15_IOT97A) A44(BANK1_F13_IOT80A) A45(GND) A46(GND) A47(BANK1_A14_IOT95B) A48(BANK5_J16_IOR47A) A49(BANK1_A13_IOT95A) A50(BANK5_J17_IOR39B) A51(GND) A52(BANK5_K17_IOR39A) A53(BANK1_B13_IOT93B) A54(BANK4_H15_IOR22B) A55(BANK1_C13_IOT93A) A56(BANK4_J15_IOR22A) A57(GND) A58(BANK4_H14_IOR26B) A59(BANK1_C15_IOT85B) A60(BANK4_J14_IOR26A) A61(BANK1_C14_IOT85A) A62(BANK4_G16_IOR24B) A63(GND) A64(BANK4_G15_IOR24A) A65(BANK1_E14_IOT78B) A66(BANK4_G13_IOR20B) A67(BANK1_E13_IOT78A) A68(BANK4_H13_IOR20A) A69(GND) A70(GND) A71(Q0_REFCLKM_1) A72(Q0_LN3_RXM_I) A73(Q0_REFCLKP_1) A74(Q0_LN3_RXP_I) A75(GND) A76(GND) A77(Q0_LN1_TXM_O) A78(Q0_LN2_RXM_I) A79(Q0_LN1_TXP_O) A80(Q0_LN2_RXP_I) A81(GND) A82(GND) A83(Q0_LN2_TXM_O) A84(Q0_LN1_RXM_I) A85(Q0_LN2_TXP_O) A86(Q0_LN1_RXP_I) A87(GND) A88(GND) A89(Q0_LN3_TXM_O) A90(Q0_LN0_RXM_I) A91(Q0_LN3_TXP_O) A92(Q0_LN0_RXP_I) A93(GND) A94(GND) A95(Q0_LN0_TXM_O) A96(Q0_REFCLKM_0) A97(Q0_LN0_TXP_O) A98(Q0_REFCLKP_0) A99(GND) A100(GND) B1(VCCIO_678) B2(BANK7_W22_IOB104B) B3(BANK8_Y22_IOB99B) B4(BANK7_W21_IOB104A) B5(BANK8_Y21_IOB99A) B6(BANK8_V20_IOB95B) B7(BANK8_AB22_IOB97B) B8(BANK8_U20_IOB95A) B9(BANK8_AB21_IOB97A) B10(BANK5_M17) B11(BANK7_AA21_IOB102B) B12(BANK6_P17_IOB140B) B13(BANK7_AA20_IOB102A) B14(BANK6_N17_IOB140A) B15(BANK8_AB20_IOB85B) B16(BANK5_M16_IOR52B) B17(BANK8_AA19_IOB85A) B18(BANK5_M15_IOR52A) B19(BANK8_W20_IOB93B) B20(BANK6_N15) B21(BANK8_W19_IOB93A) B22(BANK6_N13_IOB138A) B23(BANK8_AB18_IOB77B) B24(BANK6_N14_IOB138B) B25(BANK8_AA18_IOB77A) B26(BANK7_Y17) B27(BANK8_Y19_IOB87B) B28(BANK7_AB17) B29(BANK8_Y18_IOB87A) B30(BANK7_AA16) B31(BANK8_W17_IOB79B) B32(BANK5_M13_IOR50A) B33(BANK8_V17_IOB79A) B34(BANK5_L13_IOR50B) B35(BANK8_U18_IOB75B) B36(BANK7_AB16) B37(BANK8_U17_IOB75A) B38(BANK7_AA15) B39(BANK7_W16) B40(BANK8_AB15) B41(BANK6_U16) B42(BANK7_Y16) B43(BANK2_T16) B44(BANK7_W15) B45(BANK6_T15) B46(BANK6_V15) B47(GND) B48(BANK8_W14) B49(BANK6_R16_IOB142B) B50(BANK6_U15) B51(BANK6_P15_IOB142A) B52(BANK9_Y14) B53(GND) B54(BANK8_V14) B55(BANK6_R14_IOB146B) B56(BANK9_Y13) B57(BANK6_P14_IOB146A) B58(BANK8_AA14) B59(GND) B60(BANK9_AA13) B61(BANK6_K14_IOB36B) B62(BANK9_AB13) B63(BANK6_K13_IOB36A) B64(BANK9_Y12) B65(GND) B66(BANK9_AB12) B67(VCCIO_138B5) B68(BANK9_V10) B69(BANK3_U9_MODE2) B70(BANK9_W11) B71(BANK3_U10_MODE1) B72(BANK9_Y11) B73(BANK3_U11_MODE0) B74(BANK9_W10) B75(BANK3_U8) B76(BANK9_AB11) B77(GND) B78(BANK9_AA11) B79(GND) B80(BANK9_AB10) B81(GND) B82(BANK9_AA10) B83(GND) B84(BANK9_AA9) B85(GND) B86(BANK9_W12) B87(GND) B88(BANK7_V13) B89(5V0) B90(BANK6_T14) B91(5V0) B92(N9_ADCTN) B93(5V0) B94(N10_ADCTP) B95(5V0) B96(M9_ADCVN) B97(5V0) B98(L10_ADCVP) B99(5V0) B100(GND) C1(GND) C2(GND) C3(BANK12_T13_JTAG_TMS) C4(BANK8_V19_IOB81B) C5(BANK12_U13_JTAG_TDO) C6(BANK8_V18_IOB81A) C7(BANK12_V12_JTAG_TCK) C8(GND) C9(BANK12_R13_JTAG_TDI) C10(BANK7_U22_IOB117A_PUDC) C11(GND) C12(BANK6_T18_IOB144B) C13(BANK7_U21_IOB115B) C14(BANK6_R18_IOB144A) C15(BANK7_T21_IOB115A) C16(GND) C17(GND) C18(BANK6_R17_IOB136B) C19(BANK7_T20_IOB111B) C20(BANK6_P16_IOB136A) C21(GND) C22(GND) C23(BANK7_R19_IOB113B) C24(BANK5_L14_IOR48A) C25(BANK7_P19_IOB113A) C26(BANK5_L15_IOR48B) C27(GND) C28(BANK5_N20_IOR70A) C29(VCCIO_45) C30(BANK5_M20_IOR70B) C31(BANK5_N22_IOR63A) C32(BANK4_L16_IOR34A) C33(BANK5_M22_IOR63B) C34(BANK4_K16_IOR34B) C35(GND) C36(BANK7_P20) C37(BANK5_M21_IOR68A) C38(GND) C39(BANK5_L21_IOR68B) C40(BANK5_N18_IOR72A) C41(BANK5_L19_IOR61A) C42(BANK5_N19_IOR72B) C43(BANK5_L20_IOR61B) C44(BANK5_M18_IOR66A) C45(BANK5_K21_IOR59A) C46(BANK5_L18_IOR66B) C47(BANK5_K22_IOR59B) C48(BANK5_K18_IOR57A) C49(BANK5_J22_IOR45A) C50(BANK5_K19_IOR57B) C51(BANK5_H22_IOR45B) C52(BANK4_H17_IOR32A) C53(BANK5_J20_IOR54A) C54(BANK4_H18_IOR32B) C55(BANK5_J21_IOR54B) C56(BANK5_J19_IOR41A) C57(BANK4_G17_IOR30A) C58(BANK5_H19_IOR41B) C59(BANK4_G18_IOR30B) C60(GND) C61(BANK3_N12_RECONFIG) C62(BANK5_H20_IOR43A) C63(GND) C64(BANK5_G20_IOR43B) C65(BANK2_G21_IOT144A) C66(GND) C67(BANK2_G22_IOT144B) C68(BANK2_F19_IOT124A) C69(BANK2_F18_IOT117A) C70(BANK2_F20_IOT124B) C71(BANK2_E18_IOT117B) C72(BANK2_F21) C73(BANK2_C22_IOT133A) C74(BANK2_E22_IOT140A) C75(BANK2_B22_IOT133B) C76(BANK2_D22_IOT140B) C77(BANK3_G11_DONE) C78(BANK2_E21_IOT138A) C79(BANK3_U12_READY) C80(BANK2_D21_IOT138B)

## Notes on the sheets
sheet 1
- GCLK
- GCLK
- GCLK
- GCLK
- GCLK
- GCLK
- GCLK
- GCLK
- GCLK
- GCLK
- GCLK
- GCLK
- GCLK
- GCLK
- GCLK
sheet 3
- 1V8 6A
- 1V3 A 1.2A
- 3V3 800mA
- 1V3 B 1.2A
- PowerGood
sheet 4
- STM32F411CEU6
- 未等长
- 未等长
- 复位
- Voltage Convert
